# Altium project SingleChip-Rev2.PrjPcb (part 7 of 8)

## Sheet SFP_10GbE_Port0.SchDoc: =ProjectTitle
size A3; Author: Jaime I. Chait; Organization: NWES LLC; Address1: 111 SW 5th Ave, STE 3150; Address2: Portland, OR 97204; DocumentNumber: SCH-0001; Revision: 2; SheetNumber: 17; SheetTotal: 19
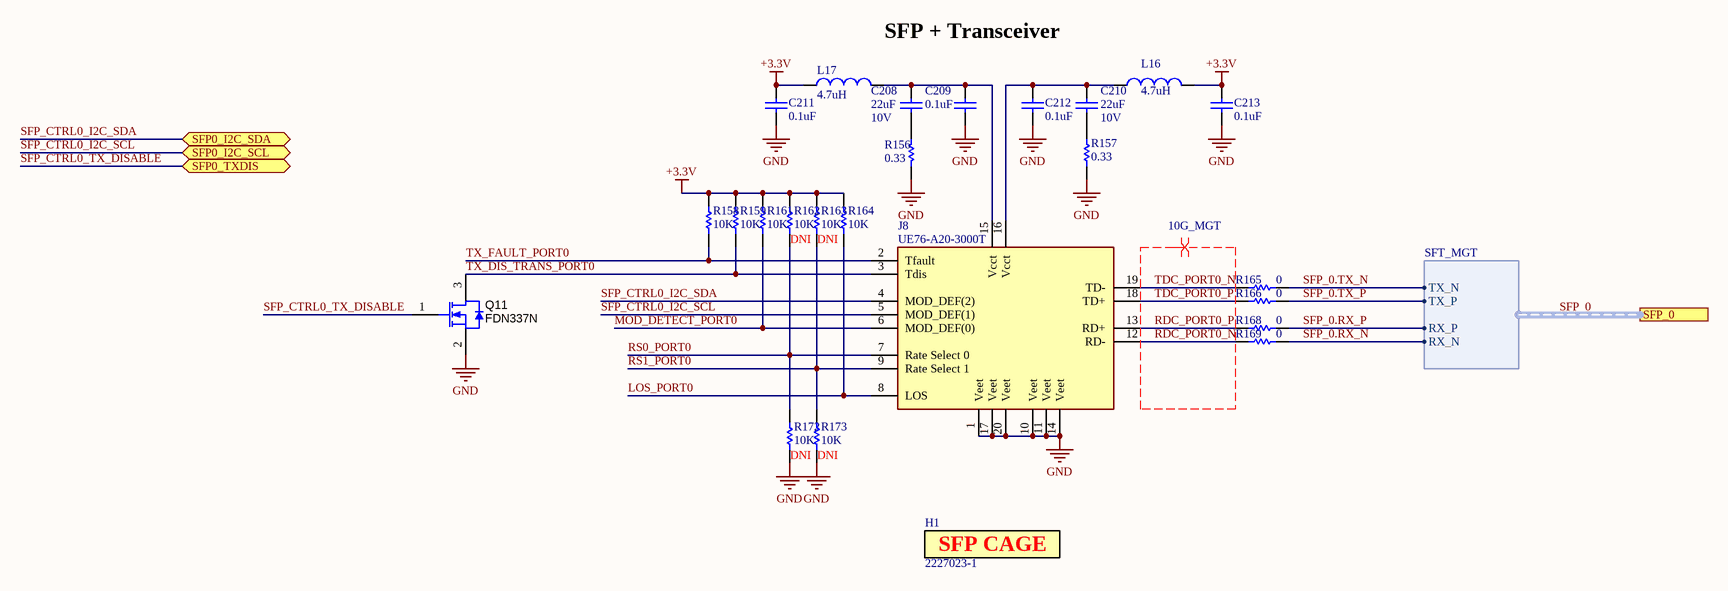
[diagram p13: SFP_10GbE_Port0.SchDoc]

### Parts
C208  22uF  Voltage Rating: 10V  [CAPC1608X100N]
C209  0.1uF  [CAPC1005X55USR]
C210  22uF  Voltage Rating: 10V  [CAPC1608X100N]
C211  0.1uF  [CAPC1005X55USR]
C212  0.1uF  [CAPC1005X55USR]
C213  0.1uF  [CAPC1005X55USR]
H1  2227023-1  [TE_2227023-1]
J8  UE76-A20-3000T  [AMPHENOL_UE76-A20-3000T]
L16  4.7uH  [DFE252012P]
L17  4.7uH  [DFE252012P]
Q11  FDN337N  [SOT-23]
R156  0.33  [RESC1608X55N]
R157  0.33  [RESC1608X55N]
R158  10K  [RESC1005X40USR]
R159  10K  [RESC1005X40USR]
R161  10K  [RESC1005X40USR]
R162  10K  [RESC1005X40USR]
R163  10K  [RESC1005X40USR]
R164  10K  [RESC1005X40USR]
R165  0  [RESC1005X40USR]
R166  0  [RESC1005X40USR]
R168  0  [RESC1005X40USR]
R169  0  [RESC1005X40USR]
R172  10K  [RESC1005X40USR]
R173  10K  [RESC1005X40USR]

### Ports
SFP0_I2C_SCL (bidir), SFP0_I2C_SDA (bidir), SFP0_TXDIS (bidir), SFP_0 (harness SFT_MGT)

### Harnesses
SFT_MGT: TX_N, TX_P, RX_P, RX_N

### Nets
+3.3V: C211.2 C213.2 L16.2 L17.2 R158.2 R159.2 R161.2 R162.2 R163.2 R164.2
GND: C209.1 C211.1 C212.1 C213.1 J8.1(Veet) J8.10(Veet) J8.11(Veet) J8.14(Veet) J8.17(Veet) J8.20(Veet) Q11.2(S) R156.1 R157.1 R172.1 R173.1
LOS_PORT0: J8.8(LOS) R164.1
MOD_DETECT_PORT0: J8.6(MOD_DEF(0)) R161.1
RDC_PORT0_N: J8.12(RD-) R169.1
RDC_PORT0_P: J8.13(RD+) R168.1
RS0_PORT0: J8.7(Rate_Select_0) R162.1 R172.2
RS1_PORT0: J8.9(Rate_Select_1) R163.1 R173.2
SFP_0.RX_N: R169.2 ; port SFP_0.RX_N
SFP_0.RX_P: R168.2 ; port SFP_0.RX_P
SFP_0.TX_N: R165.2 ; port SFP_0.TX_N
SFP_0.TX_P: R166.2 ; port SFP_0.TX_P
SFP_CTRL0_I2C_SCL: J8.5(MOD_DEF(1)) ; port SFP0_I2C_SCL
SFP_CTRL0_I2C_SDA: J8.4(MOD_DEF(2)) ; port SFP0_I2C_SDA
SFP_CTRL0_TX_DISABLE: Q11.1(G) ; port SFP0_TXDIS
TDC_PORT0_N: J8.19(TD-) R165.1
TDC_PORT0_P: J8.18(TD+) R166.1
TX_DIS_TRANS_PORT0: J8.3(Tdis) Q11.3(D) R159.1
TX_FAULT_PORT0: J8.2(Tfault) R158.1
NetC208_1: C208.1 C209.2 J8.15(Vcct) L17.1
NetC208_2: C208.2 R156.2
NetC210_1: C210.1 C212.2 J8.16(Vcct) L16.1
NetC210_2: C210.2 R157.2

### Buses and harness runs
harness SFP_0 = port SFP_0

### Layout directives
differential pair; differential pair class 10G_MGT: RDC_PORT0_N, RDC_PORT0_P, TDC_PORT0_N, TDC_PORT0_P

### Notes on the sheet
- SFP + Transceiver
- (near R162) DNI
- (near R163) DNI
- (near R172) DNI
- (near R173) DNI
- Title
- Size:
- Date:
- A4
- Number:
- Time:
- Revision:
- Sheet
- of
- File:
- (in symbol TE_2227023-1) SFP CAGE

### Library data of the parts
C208 C210 = CAP CER 22UF 10V X5R 0603: Multilayer Ceramic Capacitor, 22 uF, 10 V, ± 20%, X5R, 0603 [1608 Metric]; Manufacturer: TDK; Manufacturer Part Number: C1608X5R1A226M080AC; Supplier 1: Digi-Key; RoHS: Yes; Category: Ceramic Capacitors; Stock 1: 4100481; Pricing 1: 1=0.45000, 10=0.31300, 50=0.21920, 100=0.18790, 500=0.14090, 1000=0.11898 (USD); Mount: Surface Mount; Case/Package: 0603; Case Code (Metric): 1608; Case Code (Imperial): 0603; Dielectric Material: Ceramic; Weight: 7.1E-05oz; Min Operating Temperature: -55°C; Max Operating Temperature: 85°C; Tolerance: 20%; Capacitance: 22uF; Packaging: Tape and Reel; Voltage Rating (DC): 10V; Termination: SMD/SMT; Series: C; Package Quantity: 4000; Dielectric: X5R; Resistor Type: Ceramic; Length: 1.6mm; Width: 0.8mm; Height: 0.8mm; Thickness: 0.035inch; Depth: 0.8mm; Reach SVHC Compliant: Yes; Lead Free: Lead Free; RoHS Compliant: Yes; ComponentLink1URL: https://datasheet.ciiva.com/6274/tdkmlcccaprange-6274860.pdf?src-supplier=Digi-Key; ComponentLink1Description: https://datasheet.ciiva.com/6274/tdkmlcccaprange-6274860.pdf?src-supplier=Digi-Key; ComponentLink2URL: https://datasheet.ciiva.com/6274/tdkmlcccaprange-6274859.pdf?src-supplier=Digi-Key; ComponentLink2Description: https://datasheet.ciiva.com/6274/tdkmlcccaprange-6274859.pdf?src-supplier=Digi-Key; ComponentLink3URL: https://datasheet.ciiva.com/6274/tdkmlcccaprange-6274861.pdf?src-supplier=Digi-Key; ComponentLink3Description: https://datasheet.ciiva.com/6274/tdkmlcccaprange-6274861.pdf?src-supplier=Digi-Key; ComponentLink4URL: https://datasheet.ciiva.com/24216/mlcc-commercial-general-en-24216575.pdf?src-supplier=Mouser; ComponentLink4Description: https://datasheet.ciiva.com/24216/mlcc-commercial-general-en-24216575.pdf?src-supplier=Mouser; Supplier Part Number 1: 445-9077-1-ND
C209 C211-C213 = CAP CER 0.1UF 25V X5R 0402: Manufacturer Part Number: CL05A104KA5NNNC; Manufacturer: Samsung Electro-Mechanics; Supplier Part Number 1: 1276-1043-1-ND; Package: 0402; Height: 0.55mm; Supplier 1: Digi-Key; value: 0.1uF
H1 = TE_2227023-1: Connector Accessories 1 Port SFP Cage Press Fit Right Angle Through Hole Nickel Tray; Manufacturer: TE Connectivity AMP; Data Rate: 4Gbps; Number of Ports: 1; PCB Thickness: 0.059inch; Tail Length: 3mm; Supplier 1: Digi-Key; Supplier Part Number 1: A120615-ND; Manufacturer Part Number: 2227023-1; RoHS: Yes; Category: Connectors; Stock: 3865; Pricing: 1=2.23000, 24=1.98875, 48=1.97854, 96=1.95823, 240=1.79675, 456=1.78667, 960=1.62516, 2400=1.45356 (USD); Mounting Technology: Through Hole; Packaging: Tray; Termination: Press-Fit; Connector Type: SFP; Features: Shielded; Series: -; Number of Positions: 1; ELV: Compliant; RoHS Compliant: Yes; ComponentLink1URL: https://datasheet.ciiva.com/45236/eng-cd-2227023-1-45236427.pdf?src-supplier=Avnet; ComponentLink1Description: https://datasheet.ciiva.com/45236/eng-cd-2227023-1-45236427.pdf?src-supplier=Avnet
J8 = UE76-A20-3000T: Conn SFP+ RCP 20 POS 0.8mm Solder RA SMD 20 Terminal 1 Port T/R; Manufacturer: Amphenol Communications Solutions; Supplier 1: Future Electronics; Manufacturer Part Number: UE76-A20-3000T; RoHS: No; Stock 1: 500; Pricing 1: 500=0.81500, 1000=0.79500, 1500=0.78000, 2000=0.77500, 2500=0.75000 (USD); Supplier Part Number 1: 9135124
L16 L17 = FIXED IND 4.7UH 2A 200 MOHM SMD: Manufacturer: Murata; Manufacturer Part Number: DFE252012P-4R7M=P2; Core Material: Ferrite; Shielding: Shielded; DC Resistance (DCR): 200mR; Test Frequency: 1MHz; Max DC Current: 1.4A; Tolerance: 20%; Supplier 1: Digi-Key; RoHS: Yes; Category: Fixed Inductors; Stock 1: 151905; Pricing 1: 1=0.31000, 10=0.27500, 25=0.24040, 50=0.20600, 100=0.18890, 250=0.17168, 500=0.16140, 1000=0.12362 (USD); Mount: Surface Mount; Case/Package: 1008; Case Code (Metric): 2520; Case Code (Imperial): 1008; Min Operating Temperature: -40°C; Max Operating Temperature: 125°C; Inductance: 4.7uH; Packaging: Tape and Reel; Resistor Type: Wirewound,Metal Alloy; Current Rating: 2A; Length: 0.098inch; Width: 0.079inch; Height - Seated (Max): 0.047inch; Depth: 2mm; RoHS Compliant: Yes; ComponentLink1URL: http://www.farnell.com/datasheets/2550138.pdf?src-supplier=Farnell; ComponentLink1Description: http://www.farnell.com/datasheets/2550138.pdf?src-supplier=Farnell; ComponentLink2URL: http://www.toko.co.jp/products/pdf/inductors/dfe252012p.pdf?src-supplier=Avnet; ComponentLink2Description: http://www.toko.co.jp/products/pdf/inductors/dfe252012p.pdf?src-supplier=Avnet; ComponentLink3URL: http://www.farnell.com/datasheets/2550138.pdf?src-supplier=Newark; ComponentLink3Description: http://www.farnell.com/datasheets/2550138.pdf?src-supplier=Newark; ComponentLink4URL: http://www.murata.com/~/media/webrenewal/products/inductor/chip/tokoproducts/wirewoundmetalalloychiptype/m_dfe252012p.ashx?src-supplier=Digi-Key; ComponentLink4Description: http://www.murata.com/~/media/webrenewal/products/inductor/chip/tokoproducts/wirewoundmetalalloychiptype/m_dfe252012p.ashx?src-supplier=Digi-Key; ComponentLink5URL: https://www.murata.com/~/media/webrenewal/products/inductor/chip/tokoproducts/wirewoundmetalalloychiptype/m_dfe252012p.ashx?src-supplier=Digi-Key; ComponentLink5Description: https://www.murata.com/~/media/webrenewal/products/inductor/chip/tokoproducts/wirewoundmetalalloychiptype/m_dfe252012p.ashx?src-supplier=Digi-Key; Supplier Part Number 1: 490-10651-1-ND
Q11 = MOSFET N-CH 30V 2.2A SUPERSOT3: MOSFET N-CH 30V 2.2A SSOT3; Manufacturer: ON Semiconductor / Fairchild; Drain to Source Resistance: 65mR; Gate to Source Voltage (Vgs): 8V; Power Dissipation: 500mW; Turn-Off Delay Time: 17ns; Element Configuration: Single; Rise Time: 10ns; Turn-On Delay Time: 4ns; Input Capacitance: 300pF; Number of Elements: 1; Threshold Voltage: 700mV; Polarity: N-CHANNEL; Supplier 1: Digi-Key; Manufacturer Part Number: FDN337N; RoHS: Yes; Category: MOSFETs; Stock 1: 48367; Pricing 1: 1=0.49000, 10=0.42000, 100=0.31350, 500=0.24636, 1000=0.19037 (USD); Mount: Surface Mount; Case/Package: TO-236-3; Number of Pins: 3; Contact Plating: Tin,Matte; Weight: 0.03g; Min Operating Temperature: -55°C; Max Operating Temperature: 150°C; Continuous Drain Current (ID): 2.2A; Packaging: Tape and Reel; Drain to Source Breakdown Voltage: 30V; Max Power Dissipation: 500mW; Drain to Source Voltage (Vdss): 30V; Fall Time: 10ns; Package Quantity: 3000; Rds On Max: 65mR; Voltage Rating (DC): 30V; Current Rating: 2.2A; On-State Resistance: 65mR; Series: -; Drain-source On Resistance-Max: 65mR; Dual Supply Voltage: 30V; Termination: SMD/SMT; Nominal Vgs: 700mV; Length: 2.92mm; Width: 3.05mm; Height: 0.94mm; Lead Free: Lead Free; RoHS Compliant: Yes; Reach SVHC Compliant: Yes; ComponentLink1URL: https://datasheet.ciiva.com/14092/fdn337n-eng-datasheet-14092051.pdf?src-supplier=Distrelec; ComponentLink1Description: https://datasheet.ciiva.com/14092/fdn337n-eng-datasheet-14092051.pdf?src-supplier=Distrelec; ComponentLink2URL: https://datasheet.ciiva.com/4442/fdn337n-44286-4442315.pdf?src-supplier=Mouser; ComponentLink2Description: https://datasheet.ciiva.com/4442/fdn337n-44286-4442315.pdf?src-supplier=Mouser; ComponentLink3URL: https://datasheet.ciiva.com/19470/871017-19470804.pdf?src-supplier=Jameco; ComponentLink3Description: https://datasheet.ciiva.com/19470/871017-19470804.pdf?src-supplier=Jameco; ComponentLink4URL: https://datasheet.ciiva.com/6037/fdn337n-6037720.pdf?src-supplier=Farnell; ComponentLink4Description: https://datasheet.ciiva.com/6037/fdn337n-6037720.pdf?src-supplier=Farnell; ComponentLink5URL: https://datasheet.ciiva.com/22681/220571-22681884.pdf?src-supplier=Element14; ComponentLink5Description: https://datasheet.ciiva.com/22681/220571-22681884.pdf?src-supplier=Element14; ComponentLink6URL: https://datasheet.ciiva.com/22655/220571-22655333.pdf?src-supplier=Element14; ComponentLink6Description: https://datasheet.ciiva.com/22655/220571-22655333.pdf?src-supplier=Element14; ComponentLink7URL: https://datasheet.ciiva.com/7968/220571-7968126.pdf?src-supplier=Element14; ComponentLink7Description: https://datasheet.ciiva.com/7968/220571-7968126.pdf?src-supplier=Element14; ComponentLink8URL: https://datasheet.ciiva.com/8115/fdn337n-8115069.pdf?src-supplier=Avnet; ComponentLink8Description: https://datasheet.ciiva.com/8115/fdn337n-8115069.pdf?src-supplier=Avnet; ComponentLink9URL: https://datasheet.ciiva.com/16931/fdn337n-16931214.pdf?src-supplier=Future+Electronics; ComponentLink9Description: https://datasheet.ciiva.com/16931/fdn337n-16931214.pdf?src-supplier=Future+Electronics; ComponentLink10URL: https://datasheet.ciiva.com/8115/fdn337n-8115063.pdf?src-supplier=Avnet; ComponentLink10Description: https://datasheet.ciiva.com/8115/fdn337n-8115063.pdf?src-supplier=Avnet; ComponentLink11URL: https://datasheet.ciiva.com/931/fdn337n-931876.pdf?src-supplier=Digi-Key; ComponentLink11Description: https://datasheet.ciiva.com/931/fdn337n-931876.pdf?src-supplier=Digi-Key; ComponentLink12URL: https://datasheet.ciiva.com/931/fdn337n-931877.pdf?src-supplier=Digi-Key; ComponentLink12Description: https://datasheet.ciiva.com/931/fdn337n-931877.pdf?src-supplier=Digi-Key; ComponentLink13URL: https://datasheet.ciiva.com/931/fdn337n-931875.pdf?src-supplier=Digi-Key; ComponentLink13Description: https://datasheet.ciiva.com/931/fdn337n-931875.pdf?src-supplier=Digi-Key; Supplier Part Number 1: FDN337NCT-ND
R156 R157 = RES 0.33 OHM 1% 1/10W 0603: Manufacturer: Panasonic Electronic Components; Manufacturer Part Number: ERJ-3RQFR33V; Supplier Part Number 1: P.33AJCT-ND; Supplier 1: Digi-Key; Height: 0.4mm; Package: 0402; value: 0.33
R158 R159 R161-R164 R172 R173 = RES 10K OHM 1% 1/16W 0402: Manufacturer: YAGEO; Manufacturer Part Number: RC0402FR-0710KL; Supplier Part Number 1: 311-10.0KLRCT-ND; Package: 0402; Height: 0.4mm; Supplier 1: Digi-Key; value: 10K; Tolerance: ±1%
R165 R166 R168 R169 = RES 0 OHM JUMPER 1/16W 0402: Manufacturer: Yageo; Manufacturer Part Number: RC0402JR-070RL; Supplier Part Number 1: 311-0.0JRTR-ND; Package: 0402; Height: 0.4mm; Supplier 1: Digi-Key; value: 0

## Sheet Clock-Gen.SchDoc: =ProjectTitle
size A3; Author: Jaime I. Chait; Organization: NWES LLC; Address1: 111 SW 5th Ave, STE 3150; Address2: Portland, OR 97204; DocumentNumber: SCH-0001; Revision: 2; SheetNumber: 18; SheetTotal: 19
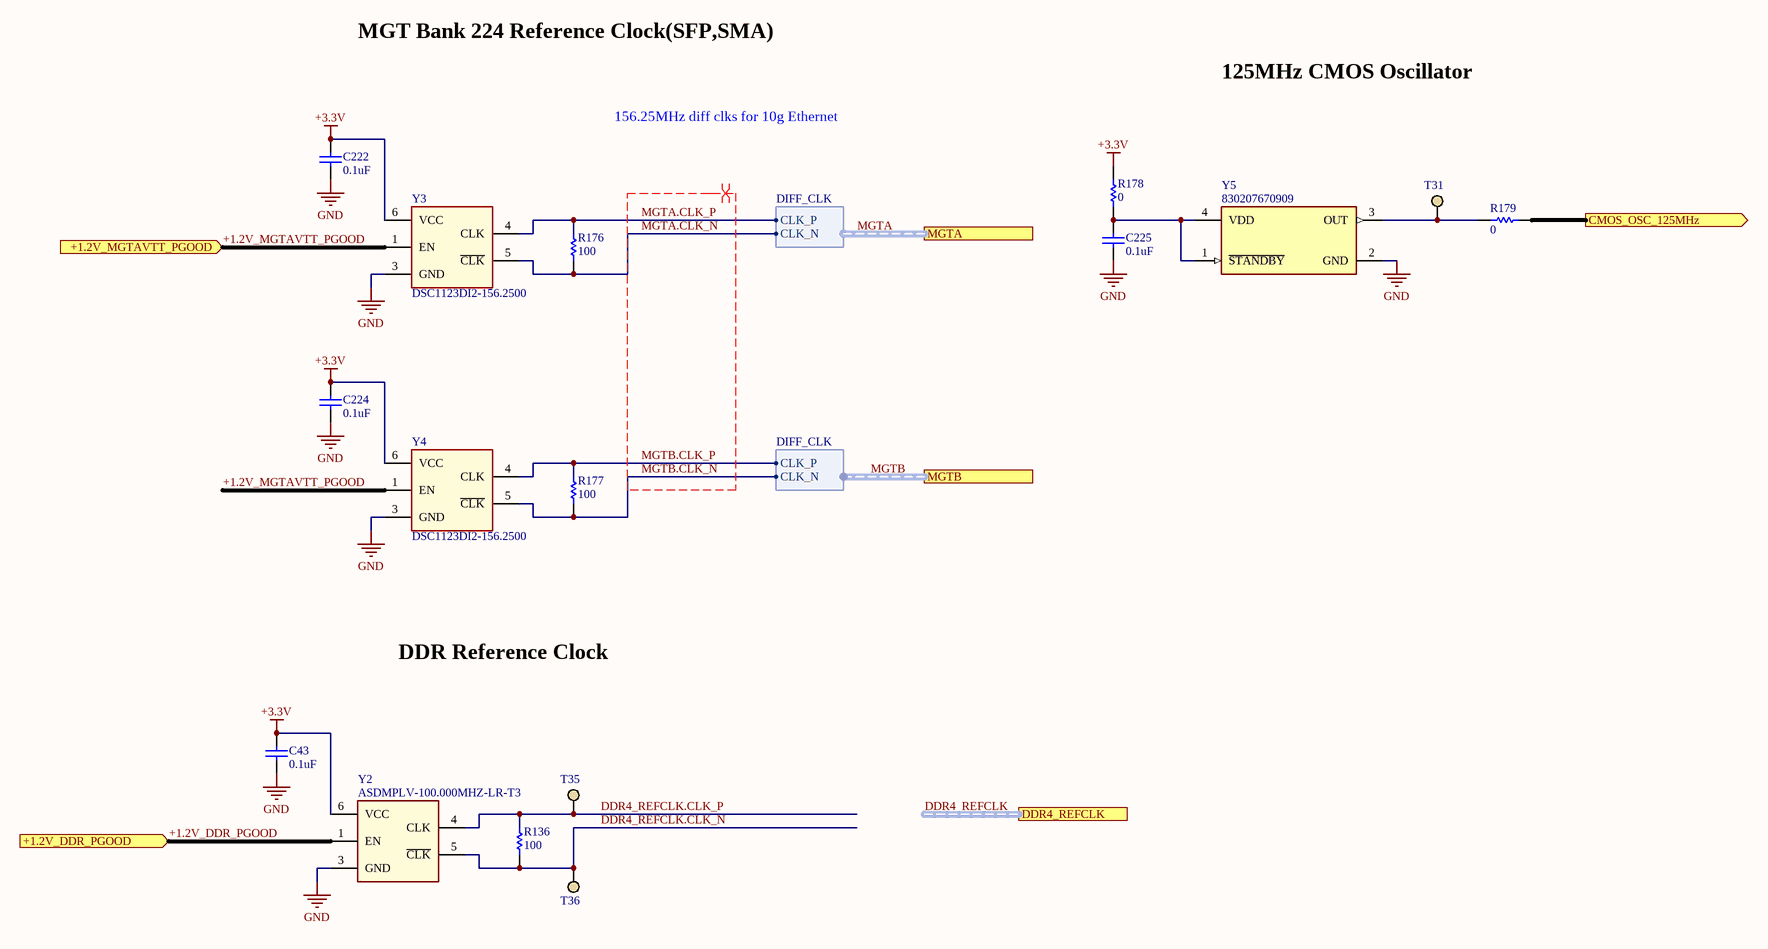
[diagram p14: Clock-Gen.SchDoc]

### Parts
C43  0.1uF  [CAPC1005X55USR]
C222  0.1uF  [CAPC1005X55USR]
C224  0.1uF  [CAPC1005X55USR]
C225  0.1uF  [CAPC1005X55USR]
R136  100  [RESC1005X40USR]
R176  100  [RESC1005X40USR]
R177  100  [RESC1005X40USR]
R178  0  [RESC1005X40USR]
R179  0  [RESC1005X40USR]
T31  TP_S  [TP_SM_1MM]  (value not drawn)  (no BOM)
T35  TP_S  [TP_SM_1MM]  (value not drawn)  (no BOM)
T36  TP_S  [TP_SM_1MM]  (value not drawn)  (no BOM)
Y2  ASDMPLV-100.000MHZ-LR-T3  [6-SMD (2.50mm x 2.00mm)]
Y3  DSC1123DI2-156.2500  [6-SMD (2.50mm x 2.00mm)]
Y4  DSC1123DI2-156.2500  [6-SMD (2.50mm x 2.00mm)]
Y5  830207670909  [XTAL_CX3225SA]

### Ports
+1.2V_DDR_PGOOD (in), +1.2V_MGTAVTT_PGOOD (in), CMOS_OSC_125MHz (out), DDR4_REFCLK (harness DIFF_CLK), MGTA (harness DIFF_CLK), MGTB (harness DIFF_CLK)

### Harnesses
DIFF_CLK: CLK_P, CLK_N

### Nets
+3.3V: C43.1 C222.1 C224.1 R178.1 Y2.6(VCC) Y3.6(VCC) Y4.6(VCC)
GND: C43.2 C222.2 C224.2 C225.2 Y2.3(GND) Y3.3(GND) Y4.3(GND) Y5.2(GND)
+1.2V_DDR_PGOOD: Y2.1(EN) ; port +1.2V_DDR_PGOOD
+1.2V_MGTAVTT_PGOOD: Y3.1(EN) Y4.1(EN) ; port +1.2V_MGTAVTT_PGOOD
CMOS_OSC_125MHz: R179.2 ; port CMOS_OSC_125MHz
DDR4_REFCLK.CLK_N: R136.1 T36.1 Y2.5(~{CLK})
DDR4_REFCLK.CLK_P: R136.2 T35.1 Y2.4(CLK)
MGTA.CLK_N: R176.1 Y3.5(~{CLK}) ; port MGTA.CLK_N
MGTA.CLK_P: R176.2 Y3.4(CLK) ; port MGTA.CLK_P
MGTB.CLK_N: R177.1 Y4.5(~{CLK}) ; port MGTB.CLK_N
MGTB.CLK_P: R177.2 Y4.4(CLK) ; port MGTB.CLK_P
NetC225_1: C225.1 R178.2 Y5.1(~{STANDBY}) Y5.4(VDD)
NetR179_1: R179.1 T31.1 Y5.3(OUT)

### Buses and harness runs
harness DDR4_REFCLK = port DDR4_REFCLK
harness MGTA = port MGTA
harness MGTB = port MGTB

### Layout directives
differential pair: MGTA.CLK_N, MGTA.CLK_P, MGTB.CLK_N, MGTB.CLK_P

### Notes on the sheet
- MGT Bank 224 Reference Clock(SFP,SMA)
- 125MHz CMOS Oscillator
- 156.25MHz diff clks for 10g Ethernet
- DDR Reference Clock
- Title
- Size:
- Date:
- A4
- Number:
- Time:
- Revision:
- Sheet
- of
- File:

### Library data of the parts
C43 C222 C224 C225 = CAP CER 0.1UF 25V X5R 0402: as C209 on sheet SFP_10GbE_Port0; Supplier Part Number 1: 1276-1043-1-ND; Package: 0402; Height: 0.55mm; Supplier 1: Digi-Key; value: 0.1uF
R136 R176 R177 = RES 100 OHM 1% 1/16W 0402: Manufacturer: YAGEO; Manufacturer Part Number: RC0402FR-07100RL; Supplier Part Number 1: 311-100LRCT-ND; Supplier 1: Digi-Key; Height: 0.4mm; Package: 0402; value: 100
R178 R179 = RES 0 OHM JUMPER 1/16W 0402: as R165 on sheet SFP_10GbE_Port0; Supplier Part Number 1: 311-0.0JRTR-ND; Package: 0402; Height: 0.4mm; Supplier 1: Digi-Key; value: 0
T31 T35 T36 = Test point PAD: test point
Y2 = ASDMPLV-100.000MHZ-LR-T3: Oscillator MEMS 100MHz ±25ppm (Stability) LVDS 52% 2.5V/3.3V 6-Pin QFN SMD T/R; Manufacturer: Abracon; Load Capacitance: 2pF; Max Supply Voltage: 3.6V; Min Supply Voltage: 2.25V; Max Supply Current: 32mA; Supplier 1: Newark; Manufacturer Part Number: ASDMPLV-100.000MHZ-LR-T3; RoHS: Yes; Category: Oscillators; Pricing 1: 1=5.72000, 25=5.68000, 50=5.45000, 100=4.95000, 250=4.83000, 500=4.71000, 1000=4.19000, 3000=4.19000 (USD); Mount: Surface Mount; Case/Package: SMD/SMT; Number of Pins: 6; Min Operating Temperature: -40°C; Max Operating Temperature: 85°C; Packaging: Tape and Reel; Frequency: 100MHz; Frequency Stability: 25ppm; Termination: Solder; Output Format: LVDS; Series: Pure Silicon™ ASDMP; Length: 0.098inch; Width: 0.079inch; Height: 0.033inch; ComponentLink1URL: https://datasheet.ciiva.com/6724/asdmp-6724229.pdf?src-supplier=Digi-Key; ComponentLink1Description: https://datasheet.ciiva.com/6724/asdmp-6724229.pdf?src-supplier=Digi-Key; ComponentLink2URL: https://datasheet.ciiva.com/6724/asdmp-6724565.pdf?src-supplier=Digi-Key; ComponentLink2Description: https://datasheet.ciiva.com/6724/asdmp-6724565.pdf?src-supplier=Digi-Key; Supplier Part Number 1: 56AC7564
Y3 Y4 = DSC1123DI2-156.2500: MEMS Oscillator High Perf Single LVDS Output -40C-85C 25ppm; Manufacturer: Microchip; Frequency: 156.25MHz; Max Supply Current: 32mA; Supplier 1: Digi-Key; Manufacturer Part Number: DSC1123DI2-156.2500; RoHS: Yes; Category: Timers and Oscillators; Stock 1: 484; Pricing 1: 1=3.06000, 25=2.55000, 100=2.50500 (USD); Mount: Surface Mount; Case/Package: SMD/SMT; Min Operating Temperature: -40°C; Max Operating Temperature: 85°C; Frequency Stability: 25ppm; Packaging: Rail/Tube; Length: 0.098inch; Width: 0.079inch; Height: 0.035inch; Ratings: AEC-Q100; ComponentLink1URL: http://www.mouser.com/ds/2/268/DSC1103-23-776891.pdf?src-supplier=Mouser; ComponentLink1Description: http://www.mouser.com/ds/2/268/DSC1103-23-776891.pdf?src-supplier=Mouser; ComponentLink2URL: http://components.arrow.com/part/dataview/66696476S862967N1374?src-supplier=Arrow+Electronics; ComponentLink2Description: http://components.arrow.com/part/dataview/66696476S862967N1374?src-supplier=Arrow+Electronics; ComponentLink3URL: http://www.microchip.com/mymicrochip/filehandler.aspx?ddocname=en576728&src-supplier=Digi-Key; ComponentLink3Description: http://www.microchip.com/mymicrochip/filehandler.aspx?ddocname=en576728&src-supplier=Digi-Key; Supplier Part Number 1: DSC1123DI2-156.2500-ND
Y5 = 830207670909: Xtal Osc Xo 125.0000MHZ Cmos; Manufacturer: Wurth Electronics; Supplier 1: Digi-Key; Manufacturer Part Number: 830207670909; RoHS: No; Category: Oscillators; Stock 1: 3000; Pricing 1: 1=3.06000, 10=2.87500, 50=2.75000, 100=2.62500, 500=2.43750, 1000=2.25000 (USD); Supplier Part Number 1: 1923-830207670909CT-ND

## Sheet OX05B1S_CAM0.SchDoc: =ProjectTitle
size A3; DocumentNumber: SCH-0001; SheetNumber: 15; SheetTotal: 19
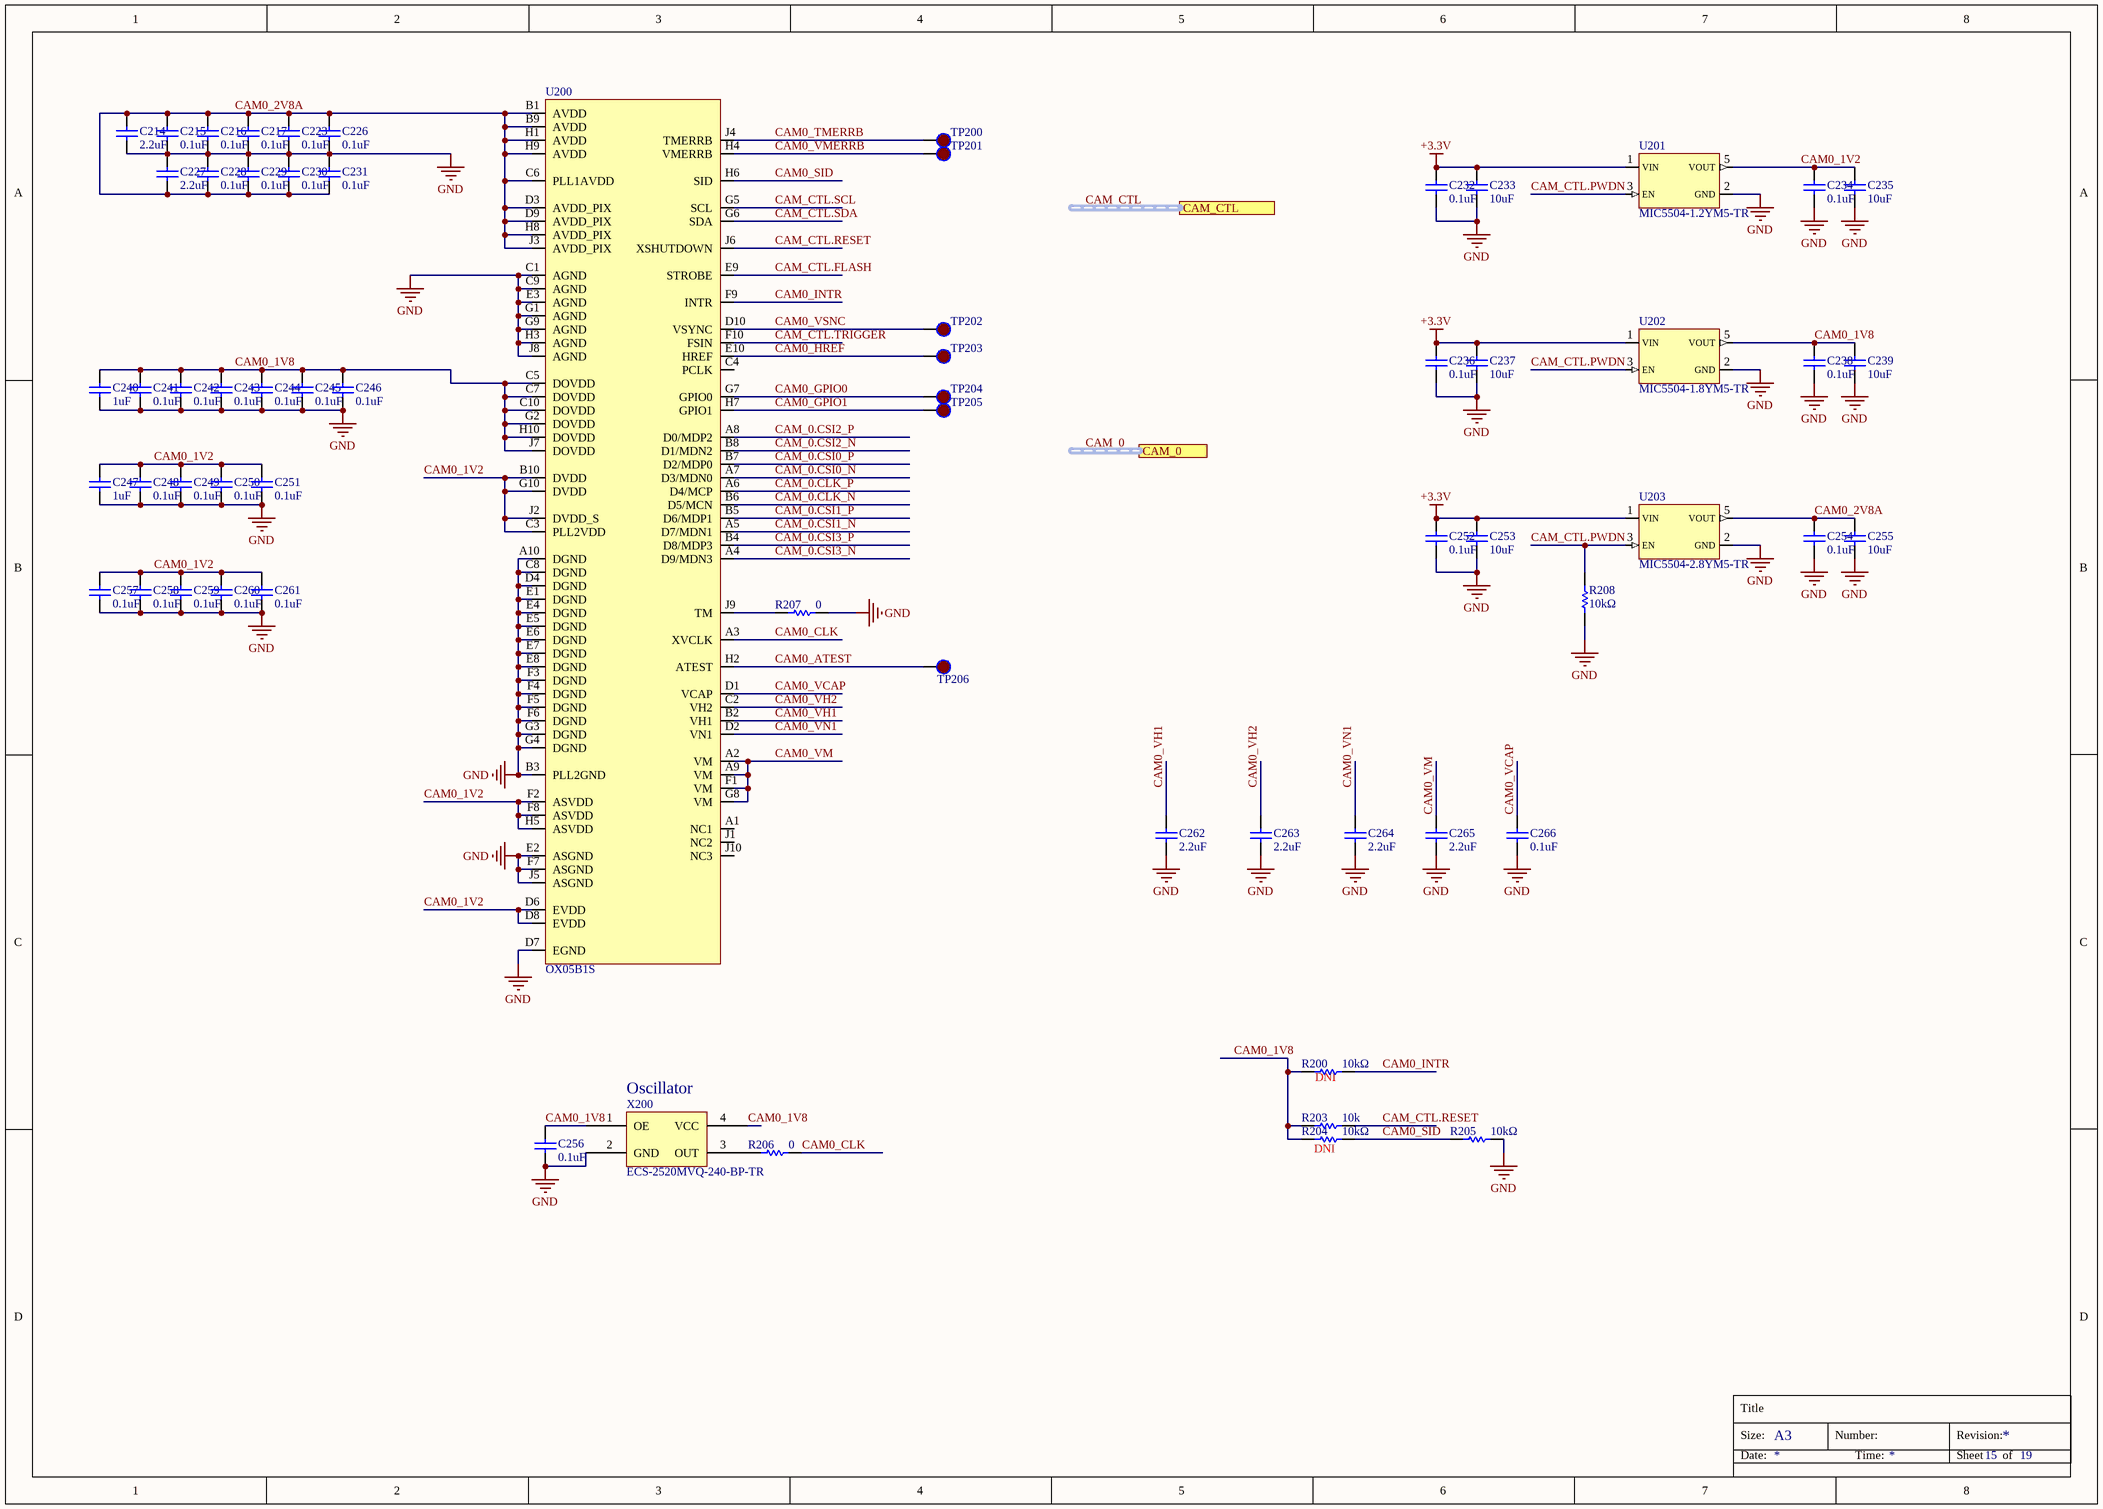
[diagram p15: OX05B1S_CAM0.SchDoc]

### Parts
C214  2.2uF  [0402_CAP_NP]
C215  0.1uF  [0402_CAP_NP]
C216  0.1uF  [0402_CAP_NP]
C217  0.1uF  [0402_CAP_NP]
C223  0.1uF  [0402_CAP_NP]
C226  0.1uF  [0402_CAP_NP]
C227  2.2uF  [0402_CAP_NP]
C228  0.1uF  [0402_CAP_NP]
C229  0.1uF  [0402_CAP_NP]
C230  0.1uF  [0402_CAP_NP]
C231  0.1uF  [0402_CAP_NP]
C232  0.1uF  [0402_CAP_NP]
C233  10uF  [0603_CAP_NP]
C234  0.1uF  [0402_CAP_NP]
C235  10uF  [0603_CAP_NP]
C236  0.1uF  [0402_CAP_NP]
C237  10uF  [0603_CAP_NP]
C238  0.1uF  [0402_CAP_NP]
C239  10uF  [0603_CAP_NP]
C240  1uF  [0402_CAP_NP]
C241  0.1uF  [0402_CAP_NP]
C242  0.1uF  [0402_CAP_NP]
C243  0.1uF  [0402_CAP_NP]
C244  0.1uF  [0402_CAP_NP]
C245  0.1uF  [0402_CAP_NP]
C246  0.1uF  [0402_CAP_NP]
C247  1uF  [0402_CAP_NP]
C248  0.1uF  [0402_CAP_NP]
C249  0.1uF  [0402_CAP_NP]
C250  0.1uF  [0402_CAP_NP]
C251  0.1uF  [0402_CAP_NP]
C252  0.1uF  [0402_CAP_NP]
C253  10uF  [0603_CAP_NP]
C254  0.1uF  [0402_CAP_NP]
C255  10uF  [0603_CAP_NP]
C256  0.1uF  [0402_CAP_NP]
C257  0.1uF  [0402_CAP_NP]
C258  0.1uF  [0402_CAP_NP]
C259  0.1uF  [0402_CAP_NP]
C260  0.1uF  [0402_CAP_NP]
C261  0.1uF  [0402_CAP_NP]
C262  2.2uF  [0402_CAP_NP]
C263  2.2uF  [0402_CAP_NP]
C264  2.2uF  [0402_CAP_NP]
C265  2.2uF  [0402_CAP_NP]
C266  0.1uF  [0402_CAP_NP]
R200  value 10kΩ  Populate: DNI  [0603_RES]  (hidden comment: 10k)
R203  10k  [0402_RES]
R204  value 10kΩ  Populate: DNI  [0603_RES]  (hidden comment: 10k)
R205  value 10kΩ  [0603_RES]  (hidden comment: 10k)
R206  0  [0603_RES]
R207  0  [0603_RES]
R208  value 10kΩ  [0603_RES]  (hidden comment: 10k)
TP200  TestPoint_1mm_SM  [TESTPAD_1mm]  (value not drawn)  (no BOM)
TP201  TestPoint_1mm_SM  [TESTPAD_1mm]  (value not drawn)  (no BOM)
TP202  TestPoint_1mm_SM  [TESTPAD_1mm]  (value not drawn)  (no BOM)
TP203  TestPoint_1mm_SM  [TESTPAD_1mm]  (value not drawn)  (no BOM)
TP204  TestPoint_1mm_SM  [TESTPAD_1mm]  (value not drawn)  (no BOM)
TP205  TestPoint_1mm_SM  [TESTPAD_1mm]  (value not drawn)  (no BOM)
TP206  TestPoint_1mm_SM  [TESTPIN_1mm]  (value not drawn)  (no BOM)
U200  OX05B1S  [BGA_OX05B1S]
U201  MIC5504-1.2YM5-TR  [SOT23-5]
U202  MIC5504-1.8YM5-TR  [SOT23-5]
U203  MIC5504-2.8YM5-TR  [SOT23-5]
X200  ECS-2520MVQ-240-BP-TR  [Active Oscillator 2520]

### Ports
CAM_0 (harness MIPI), CAM_CTL (harness CAM_CTL)

### Nets
+3.3V: C232.2 C233.2 C236.2 C237.2 C252.2 C253.2 U201.1(VIN) U202.1(VIN) U203.1(VIN)
GND: C214.1 C215.1 C216.1 C217.1 C223.1 C226.1 C227.2 C228.2 C229.2 C230.2 C231.2 C232.1 C233.1 C234.1 C235.1 C236.1 C237.1 C238.1 C239.1 C240.1 C241.1 C242.1 C243.1 C244.1 C245.1 C246.1 C247.1 C248.1 C249.1 C250.1 C251.1 C252.1 C253.1 C254.1 C255.1 C256.1 C257.1 C258.1 C259.1 C260.1 C261.1 C262.1 C263.1 C264.1 C265.1 C266.1 R205.1 R207.2 R208.2 U200.A10(DGND) U200.B3(PLL2GND) U200.C1(AGND) U200.C8(DGND) U200.C9(AGND) U200.D4(DGND) U200.D7(EGND) U200.E1(DGND) U200.E2(ASGND) U200.E3(AGND) U200.E4(DGND) U200.E5(DGND) U200.E6(DGND) U200.E7(DGND) U200.E8(DGND) U200.F3(DGND) U200.F4(DGND) U200.F5(DGND) U200.F6(DGND) U200.F7(ASGND) U200.G1(AGND) U200.G3(DGND) U200.G4(DGND) U200.G9(AGND) U200.H3(AGND) U200.J5(ASGND) U200.J8(AGND) U201.2(GND) U202.2(GND) U203.2(GND) X200.2(GND)
CAM0_1V2: C234.2 C235.2 C247.2 C248.2 C249.2 C250.2 C251.2 C257.2 C258.2 C259.2 C260.2 C261.2 U200.B10(DVDD) U200.C3(PLL2VDD) U200.D6(EVDD) U200.D8(EVDD) U200.F2(ASVDD) U200.F8(ASVDD) U200.G10(DVDD) U200.H5(ASVDD) U200.J2(DVDD_S) U201.5(VOUT)
CAM0_1V8: C238.2 C239.2 C240.2 C241.2 C242.2 C243.2 C244.2 C245.2 C246.2 C256.2 R200.2 R203.2 R204.2 U200.C5(DOVDD) U200.C7(DOVDD) U200.C10(DOVDD) U200.G2(DOVDD) U200.H10(DOVDD) U200.J7(DOVDD) U202.5(VOUT) X200.1(OE) X200.4(VCC)
CAM0_2V8A: C214.2 C215.2 C216.2 C217.2 C223.2 C226.2 C227.1 C228.1 C229.1 C230.1 C231.1 C254.2 C255.2 U200.B1(AVDD) U200.B9(AVDD) U200.C6(PLL1AVDD) U200.D3(AVDD_PIX) U200.D9(AVDD_PIX) U200.H1(AVDD) U200.H8(AVDD_PIX) U200.H9(AVDD) U200.J3(AVDD_PIX) U203.5(VOUT)
CAM0_ATEST: TP206.1 U200.H2(ATEST)
CAM0_CLK: R206.2 U200.A3(XVCLK)
CAM0_GPIO0: TP204.1 U200.G7(GPIO0)
CAM0_GPIO1: TP205.1 U200.H7(GPIO1)
CAM0_HREF: TP203.1 U200.E10(HREF)
CAM0_INTR: R200.1 U200.F9(INTR)
CAM0_SID: R204.1 R205.2 U200.H6(SID)
CAM0_TMERRB: TP200.1 U200.J4(TMERRB)
CAM0_VCAP: C266.2 U200.D1(VCAP)
CAM0_VH1: C262.2 U200.B2(VH1)
CAM0_VH2: C263.2 U200.C2(VH2)
CAM0_VM: C265.2 U200.A2(VM) U200.A9(VM) U200.F1(VM) U200.G8(VM)
CAM0_VMERRB: TP201.1 U200.H4(VMERRB)
CAM0_VN1: C264.2 U200.D2(VN1)
CAM0_VSNC: TP202.1 U200.D10(VSYNC)
CAM_0.CLK_N: U200.B6(D5/MCN)
CAM_0.CLK_P: U200.A6(D4/MCP)
CAM_0.CSI0_N: U200.A7(D3/MDN0)
CAM_0.CSI0_P: U200.B7(D2/MDP0)
CAM_0.CSI1_N: U200.A5(D7/MDN1)
CAM_0.CSI1_P: U200.B5(D6/MDP1)
CAM_0.CSI2_N: U200.B8(D1/MDN2)
CAM_0.CSI2_P: U200.A8(D0/MDP2)
CAM_0.CSI3_N: U200.A4(D9/MDN3)
CAM_0.CSI3_P: U200.B4(D8/MDP3)
CAM_CTL.FLASH: U200.E9(STROBE)
CAM_CTL.PWDN: R208.1 U201.3(EN) U202.3(EN) U203.3(EN)
CAM_CTL.RESET: R203.1 U200.J6(XSHUTDOWN)
CAM_CTL.SCL: U200.G5(SCL)
CAM_CTL.SDA: U200.G6(SDA)
CAM_CTL.TRIGGER: U200.F10(FSIN)
NetR206_1: R206.1 X200.3(OUT)
NetR207_1: R207.1 U200.J9(TM)

Not connected (* = marked no-connect by the designer): U200 A1(NC1) C4(PCLK) J1(NC2) J10(NC3)

### Buses and harness runs
harness CAM_0 = port CAM_0
harness CAM_CTL = port CAM_CTL

### Notes on the sheet
- (near X200) Oscillator
- Title
- Size:
- Date:
- A3
- Number:
- Time:
- Revision:
- Sheet
- of

### Library data of the parts
C214 C227 C262-C265 = 0402C_2.2UF_6.3V_10%_X5R: CAP CER 2.2UF 6.3V X5R ±10% 0402; Manufacturer: Murata; Manufacturer Part Number: GRM155R60J225KE95D; Unit Cost, Qty 1: $0.13; Unit Cost, Qty 500: $0.03126; Value: 2.2uF
C215-C217 C223 C226 C228-C232 C234 C236 C238 C241-C246 C248-C252 C254 C256-C261 C266 = 0402C_0.1UF_25V_10%_X7R: CAP CER 0.1UF 25V X7R 0402; Manufacturer: AVX; Manufacturer Part Number: 04023C104KAT2A; Unit Cost, Qty 1: $0.12; Unit Cost, Qty 500: $0.02758; Value: 0.1uF
C233 C235 C237 C239 C253 C255 = 0603C_10UF_10V_20%_X5R: CAP CER 10UF 10V X5R 0603; Manufacturer: Taiyo Yuden; Manufacturer Part Number: LMK107BBJ106MALT; Component Description: 10 µF ±20% 10V Ceramic Capacitor X5R 0603; Unit Cost, Qty 1: $0.18; Unit Cost, Qty 500: 0.04188; Value: 10uF
C240 C247 = 0402C_1UF_16V_10%_X5R: CAP CER 1UF 16V X5R 0402 ±10%; Manufacturer: Taiyo Yuden; Manufacturer Part Number: EMK105BJ105KV-F; Unit Cost, Qty 1: $0.14; Unit Cost, Qty 500: $0.034; Value: 1uF
R200 R204 R205 R208 = 0603R_10k_1%_0.1W: RES SMD 10K OHM 1% 1/10W 0603; Manufacturer: Yageo; Manufacturer Part Number: RC0603FR-0710KL; Component Description: Resistor 10k Ohm ±1% 0.1W 0603; Unit Cost, Qty 1: $0.10; Unit Cost, Qty 500: $0.00316
R203 = 0402R_10k_1%_0.063W: RES SMD 10K OHM 1% 1/16W 0402; Manufacturer: Yageo; Manufacturer Part Number: RC0402FR-0710KL
R206 = 0603R_0_0.1W: Resistor 0 ohm 0.1W 0603; MPN: RC0603JR-070RL; Mfg: Yageo; Unit Cost, Qty 1: $0.10; Unit Cost, Qty 500: $0.002252; Value: 0
R207 = 0603R_0_0.1W: Resistor 0 ohm 0.1W 0603; Manufacturer: Yageo; Manufacturer Part Number: RC0603JR-070RL; Unit Cost, Qty 1: $0.10; Unit Cost, Qty 500: $0.002252; Value: 0
TP200-TP206 = TestPoint_1mm_SM: Populate: DNP
U200 = OX05B1S: 1/2.53" CMOS 5MP image sensor; Manufacturer: OMNIVISION; Manufacturer Part Number: OX05B1S
U201 = MIC550x: IC REG LINEAR 1.2V 300MA SOT23-5; Manufacturer: Microchip; Dropout Voltage: 160mV; Number of Regulators: 1; Min Current Limit: 400mA; Supplier 1: Digikey; Supplier Part Number 1: 576-4878-1-ND; Manufacturer Part Number: MIC5504-1.2YM5-TR; RoHS: Yes; Category: Voltage Regulators - Linear; Stock 1: 9823; Pricing 1: 1=0.16000, 25=0.12000, 100=0.11000 (USD); Mount: Surface Mount; Case/Package: SOT-23-5; Min Operating Temperature: -40°C; Max Operating Temperature: 125°C; Packaging: Cut Tape; Output Voltage: 1.2V; Output Current: 300mA; Series: -; RoHS Compliant: Yes; ComponentLink1URL: http://www.microchip.com/mymicrochip/filehandler.aspx?ddocname=en580292&src-supplier=Digikey; ComponentLink1Description: http://www.microchip.com/mymicrochip/filehandler.aspx?ddocname=en580292&src-supplier=Digikey; ComponentLink2URL: https://datasheet.octopart.com/MIC5504-1.2YM5-TR-Microchip-datasheet-137404938.pdf?src-supplier=Future+Electronics; ComponentLink2Description: https://datasheet.octopart.com/MIC5504-1.2YM5-TR-Microchip-datasheet-137404938.pdf?src-supplier=Future+Electronics; ComponentLink3URL: https://datasheet.octopart.com/MIC5504-1.2YM5-TR-Microchip-datasheet-137453438.pdf?src-supplier=Master+Electronics; ComponentLink3Description: https://datasheet.octopart.com/MIC5504-1.2YM5-TR-Microchip-datasheet-137453438.pdf?src-supplier=Master+Electronics
U202 = MIC550x: Linear Voltage Regulator IC Positive Fixed 1 Output 1.8V 300mA SOT-23-5; Manufacturer: Microchip; Dropout Voltage: 160mV; Number of Regulators: 1; Min Current Limit: 400mA; Supplier 1: Digikey; Supplier Part Number 1: 576-4879-1-ND; Manufacturer Part Number: MIC5504-1.8YM5-TR; RoHS: Yes; Category: Voltage Regulators - Linear; Stock 1: 307926; Pricing 1: 1=0.16000, 25=0.12000, 100=0.11000 (USD); Mount: Surface Mount; Case/Package: SOT-23-5; Min Operating Temperature: -40°C; Max Operating Temperature: 125°C; Packaging: Cut Tape; Series: -; Output Voltage: 1.8V; Output Current: 300mA; RoHS Compliant: Yes
U203 = MIC550x: LDO Fixed Output Voltage Regulator MIC5504-2.8YM5-TR, 2.8V, 300mA, SOT23-5 /tape-3k/; Manufacturer: Microchip; Dropout Voltage: 160mV; Number of Regulators: 1; Min Current Limit: 400mA; Min Input Voltage: 2.5V; Max Input Voltage: 5.5V; Operating Supply Current: 42uA; Power Supply Rejection Ratio (PSRR): 60dB; Quiescent Current: 35uA; Accuracy: 3%; Supplier 1: Digikey; Supplier Part Number 1: 576-4763-1-ND; Manufacturer Part Number: MIC5504-2.8YM5-TR; RoHS: Yes; Category: Voltage Regulators - Linear; Stock 1: 39893; Pricing 1: 1=0.16000, 25=0.12000, 100=0.11000 (USD); Mount: Surface Mount; Case/Package: SOT-23-5; Number of Pins: 5; Min Operating Temperature: -40°C; Max Operating Temperature: 125°C; Packaging: Tape and Reel; Output Voltage: 2.8V; Output Current: 300mA; Nominal Output Voltage: 2.8V; Output Type: Fixed; Series: -; Number of Outputs: 1; Max Output Current: 300mA; Length: 2.9mm; Width: 1.6mm; Height: 1.1mm; Reach SVHC Compliant: No; ComponentLink1URL: https://datasheet.ciiva.com/46425/1856860-46425638.pdf?src-supplier=Element14; ComponentLink1Description: https://datasheet.ciiva.com/46425/1856860-46425638.pdf?src-supplier=Element14
X200 = Oscillator_2520: Oscillator XO 24MHz ±50ppm 15pF HCMOS 55% 1.8V/2.5V/3.3V Automotive 4-Pin Mini-CSMD T/R; Manufacturer: ECS International; Max Supply Current: 10mA; Supplier 1: Digikey; Supplier Part Number 1: 50-ECS-2520MVQ-240-BP-CT-ND; Manufacturer Part Number: ECS-2520MVQ-240-BP-TR; RoHS: Yes; Category: Oscillators; Stock 1: 12794; Pricing 1: 1=1.15000, 10=1.09900, 50=1.07380, 100=0.92040, 500=0.89484 (USD); Mount: Surface Mount; Case/Package: SMD/SMT; Min Operating Temperature: -40°C; Max Operating Temperature: 105°C; Series: MultiVolt™ ECS-2520MVQ; Frequency Stability: 50ppm; Frequency: 24MHz; Ratings: AEC-Q200; RoHS Compliant: Yes

## Sheet Serializer.SchDoc: =ProjectTitle
size A3; DocumentNumber: SCH-0001; SheetNumber: 15; SheetTotal: 19
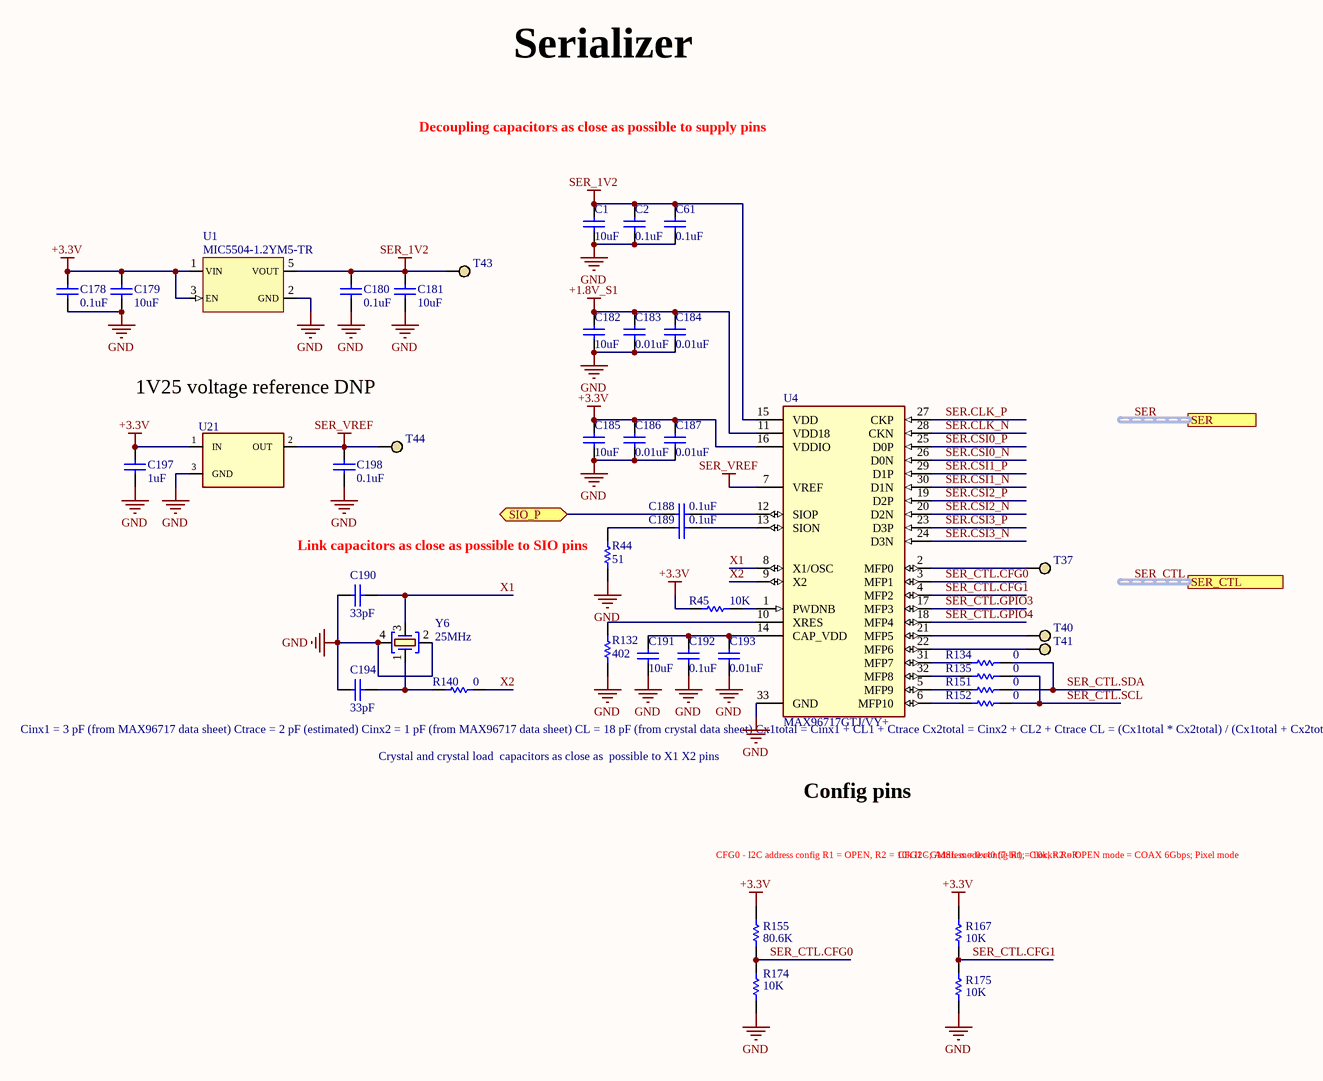
[diagram p16: Serializer.SchDoc]

### Parts
C1  10uF  [CAPC1005X55USR]
C2  0.1uF  [CAPC1005X55USR]
C61  0.1uF  [CAPC1005X55USR]
C178  0.1uF  [CAPC1005X55USR]
C179  10uF  [CAPC1608X90N]
C180  0.1uF  [CAPC1005X55USR]
C181  10uF  [CAPC1608X90N]
C182  10uF  [CAPC1005X55USR]
C183  0.01uF  [CAPC1005X55USR]
C184  0.01uF  [CAPC1005X55USR]
C185  10uF  [CAPC1005X55USR]
C186  0.01uF  [CAPC1005X55USR]
C187  0.01uF  [CAPC1005X55USR]
C188  0.1uF  [CAPC1005X55USR]
C189  0.1uF  [CAPC1005X55USR]
C190  33pF  [CAPC1005X55USR]
C191  10uF  [CAPC1005X55USR]
C192  0.1uF  [CAPC1005X55USR]
C193  0.01uF  [CAPC1005X55USR]
C194  33pF  [CAPC1005X55USR]
C197  1uF  [CAPC1005X55USR]
C198  0.1uF  [CAPC1005X55USR]
R44  51  [RESC1005X40USR]
R45  10K  [RESC1005X40USR]
R132  402  [RESC1005X40USR]
R134  0  [RESC1005X40USR]
R135  0  [RESC1005X40USR]
R140  0  [RESC1005X40USR]
R151  0  [RESC1005X40USR]
R152  0  [RESC1005X40USR]
R155  80.6K  [RESC1005X40USR]
R167  10K  [RESC1005X40USR]
R174  10K  [RESC1005X40USR]
R175  10K  [RESC1005X40USR]
T37  TP_S  [TP 1mm]  (value not drawn)  (no BOM)
T40  TP_S  [TP 1mm]  (value not drawn)  (no BOM)
T41  TP_S  [TP 1mm]  (value not drawn)  (no BOM)
T43  TP_S  [TP 1mm]  (value not drawn)  (no BOM)
T44  TP_S  [TP 1mm]  (value not drawn)  (no BOM)
U1  MIC5504-1.2YM5-TR  [SOT23-5]
U4  MAX96717GTJ/VY+  [QFN50P500X500X80-33N]
U21  REF3012AIDBZT  [SOT-23]  (value not drawn)
Y6  25MHz  [XTAL_ABM8G_3225]

### Ports
SER (harness MIPI), SER_CTL (harness SER_CTRL), SIO_P (bidir)

### Nets
+1.8V_S1: C182.2 C183.2 C184.2 U4.11(VDD18)
+3.3V: C178.2 C179.2 C185.2 C186.2 C187.2 C197.2 R45.2 R155.2 R167.2 U1.1(VIN) U1.3(EN) U4.16(VDDIO) U21.1(IN)
GND: C1.1 C2.2 C61.2 C178.1 C179.1 C180.1 C181.1 C182.1 C183.1 C184.1 C185.1 C186.1 C187.1 C190.1 C191.1 C192.2 C193.1 C194.1 C197.1 C198.1 R44.1 R132.1 R174.1 R175.1 U1.2(GND) U4.33(GND) U21.3(GND) Y6.2(SH) Y6.4(SH)
SER_1V2: C1.2 C2.1 C61.1 C180.2 C181.2 T43.1 U1.5(VOUT) U4.15(VDD)
SER_VREF: C198.2 T44.1 U4.7(VREF) U21.2(OUT)
SER.CLK_N: U4.28(CKN)
SER.CLK_P: U4.27(CKP)
SER.CSI0_N: U4.26(D0N)
SER.CSI0_P: U4.25(D0P)
SER.CSI1_N: U4.30(D1N)
SER.CSI1_P: U4.29(D1P)
SER.CSI2_N: U4.20(D2N)
SER.CSI2_P: U4.19(D2P)
SER.CSI3_N: U4.24(D3N)
SER.CSI3_P: U4.23(D3P)
SER_CTL.CFG0: R155.1 R174.2 U4.3(MFP1)
SER_CTL.CFG1: R167.1 R175.2 U4.4(MFP2)
SER_CTL.GPIO3: U4.17(MFP3)
SER_CTL.GPIO4: U4.18(MFP4)
SER_CTL.SCL: R135.2 R152.2
SER_CTL.SDA: R134.2 R151.2
X1: C190.2 U4.8(X1/OSC) Y6.3
X2: R140.2 U4.9(X2)
NetC188_1: C188.1 ; port SIO_P
NetC188_2: C188.2 U4.12(SIOP)
NetC189_1: C189.1 R44.2
NetC189_2: C189.2 U4.13(SION)
NetC191_2: C191.2 C192.1 C193.2 U4.14(CAP_VDD)
NetC194_2: C194.2 R140.1 Y6.1
NetR45_1: R45.1 U4.1(PWDNB)
NetR132_2: R132.2 U4.10(XRES)
NetR134_1: R134.1 U4.31(MFP7)
NetR135_1: R135.1 U4.32(MFP8)
NetR151_1: R151.1 U4.5(MFP9)
NetR152_1: R152.1 U4.6(MFP10)
NetT37_1: T37.1 U4.2(MFP0)
NetT40_1: T40.1 U4.21(MFP5)
NetT41_1: T41.1 U4.22(MFP6)

### Buses and harness runs
harness SER = port SER
harness SER_CTL = port SER_CTL

### Notes on the sheet
- Serializer
- Decoupling capacitors as close as possible to supply pins
- 1V25 voltage reference DNP
- (near R44) Link capacitors as close as possible to SIO pins
- Cinx1 = 3 pF (from MAX96717 data sheet)
  Ctrace = 2 pF (estimated)
  Cinx2 = 1 pF (from MAX96717 data sheet)
  CL = 18 pF (from crystal data sheet)
  Cx1total = Cinx1 + CL1 + Ctrace
  Cx2total = Cinx2 + CL2 + Ctrace
  CL = (Cx1total * Cx2total) / (Cx1total + Cx2total)
  CL1 = 33 pF
  Cl2 = 33 pF
  CX1total = 38 pF
  Cx2total = 36 pF
  CL = 18.5 pF (meets the requirements)
- Crystal and crystal load
  capacitors as close as
  possible to X1 X2 pins
- Config pins
- CFG0 - I2C address config
  R1 = OPEN, R2 = 10k
  I2C; Address = 0x40 (7-bit);
  Clock= RoR
- CFG1 - GMSL mode config
  R1 = 10k, R2 = OPEN
  mode = COAX 6Gbps; Pixel mode
- Title
- Size:
- Date:
- A3
- Number:
- Time:
- Revision:
- Sheet
- of

### Library data of the parts
C1 C182 C185 C191 = CAP CER 10UF 10V X5R 0402: Manufacturer Part Number: CL05A106MP8NUB8; Manufacturer: Samsung Electro-Mechanics; Part #: E-CAP-042; Supplier Part Number 1: 1276-6830-2-ND; Package: 0402; value: 10uF; Supplier 1: Digi-Key; Height: 0.9mm; ComponentLink1Description: New link; ComponentLink1URL: *
C2 C61 C188 C189 C192 = CAP CER 0.1UF 25V X5R 0402: as C209 on sheet SFP_10GbE_Port0; Supplier Part Number 1: 1276-1043-1-ND; Package: 0402; Height: 0.55mm; Supplier 1: Digi-Key; value: 0.1uF
C178 C180 C198 = 0402C_0.1UF_25V_10%_X7R: as C215 on sheet OX05B1S_CAM0; Value: 0.1uF
C179 C181 = 0603C_10UF_10V_20%_X5R: as C233 on sheet OX05B1S_CAM0; Value: 10uF
C183 C184 C186 C187 C193 = CAP CER 0.01uF 50V X7R 0402: CAP CER 10000PF 50V X7R 0402; Manufacturer Part Number: GCM155R71H103KA55D; Manufacturer: Murata Electronics; Supplier Part Number 1: 490-4762-1-ND; Package: 0402; Height: 0.55mm; Supplier 1: Digi-Key; value: 0.01uF
C190 C194 = CAP CER 33PF 50V C0G/NP0 0402: Manufacturer Part Number: GRM1555C1H330JA01D; Manufacturer: Murata Electronics; Part #: E-CAP-042; Supplier Part Number 1: 490-5936-1-ND; Package: 0402; Height: 0.55mm; Supplier 1: Digi-Key; value: 33pF
C197 = CAP CER 1UF 10V X5R 0402: Manufacturer Part Number: CL05A105MP5NNNC; Manufacturer: Samsung Electro-Mechanics; Part #: E-CAP-042; Supplier Part Number 1: 1276-1448-1-ND; Package: 0402; value: 1uF; Supplier 1: Digi-Key; Height: 0.55mm; ComponentLink1Description: New link; ComponentLink1URL: *
R44 = RES 51 OHM 1% 1/16W 0402: Manufacturer Part Number: RC0402FR-0751RL; Manufacturer: YAGEO; Supplier Part Number 1: 311-51.0LRCT-ND; Supplier 1: Digi-Key; Height: 0.4mm; Package: 0402; value: 51
R45 R167 R174 R175 = RES 10K OHM 1% 1/16W 0402: as R158 on sheet SFP_10GbE_Port0; Supplier Part Number 1: 311-10.0KLRCT-ND; Package: 0402; Height: 0.4mm; Supplier 1: Digi-Key; value: 10K
  R45: Tolerance: ±1%
R132 = RES 402 OHM 1% 1/16W 0402: Manufacturer Part Number: RC0402FR-07402RL; Manufacturer: YAGEO; Supplier Part Number 1: YAG3152CT-ND; Supplier 1: Digi-Key; Height: 0.4mm; Package: 0402; value: 402
R134 R135 R140 R151 R152 = RES 0 OHM JUMPER 1/16W 0402: as R165 on sheet SFP_10GbE_Port0; Supplier Part Number 1: 311-0.0JRTR-ND; Package: 0402; Height: 0.4mm; Supplier 1: Digi-Key; value: 0
R155 = RES 80.6K OHM 1% 1/16W 0402: Manufacturer: YAGEO; Manufacturer Part Number: RC0402FR-0780K6L; value: 80.6K; Supplier Part Number 1: 311-80.6KLRCT-ND; Supplier 1: Digi-Key; Height: 0.4mm; Package: 0402
T37 T40 T41 T43 T44 = Test point PAD: test point
U1 = MIC550x: as U201 on sheet OX05B1S_CAM0; Supplier 1: Digikey; Supplier Part Number 1: 576-4878-1-ND; Manufacturer Part Number: MIC5504-1.2YM5-TR; RoHS: Yes; Category: Voltage Regulators - Linear; Stock 1: 9823; Pricing 1: 1=0.16000, 25=0.12000, 100=0.11000 (USD); Mount: Surface Mount; Case/Package: SOT-23-5; Min Operating Temperature: -40°C; Max Operating Temperature: 125°C; Packaging: Cut Tape; Output Voltage: 1.2V; Output Current: 300mA; Series: -; RoHS Compliant: Yes; ComponentLink1URL: http://www.microchip.com/mymicrochip/filehandler.aspx?ddocname=en580292&src-supplier=Digikey; ComponentLink1Description: http://www.microchip.com/mymicrochip/filehandler.aspx?ddocname=en580292&src-supplier=Digikey; ComponentLink2URL: https://datasheet.octopart.com/MIC5504-1.2YM5-TR-Microchip-datasheet-137404938.pdf?src-supplier=Future+Electronics; ComponentLink2Description: https://datasheet.octopart.com/MIC5504-1.2YM5-TR-Microchip-datasheet-137404938.pdf?src-supplier=Future+Electronics; ComponentLink3URL: https://datasheet.octopart.com/MIC5504-1.2YM5-TR-Microchip-datasheet-137453438.pdf?src-supplier=Master+Electronics; ComponentLink3Description: https://datasheet.octopart.com/MIC5504-1.2YM5-TR-Microchip-datasheet-137453438.pdf?src-supplier=Master+Electronics
U4 = MAX96717GTJ/VY+: GMSL2 Compact Serializer; Manufacturer: Maxim; Supplier 1: Digikey; Supplier Part Number 1: 505-MAX96717GTJ/VY+-ND; Manufacturer Part Number: MAX96717GTJ/VY+; RoHS: No; Stock: 259; Pricing: 1=15.02, 10=10.718, 25=9.6132, 80=8.54788, 230=7.82974, 490=7.42722, 980=7.3625 (USD)
U21 = REF3012AIDBZT: 1.25V 50ppm/Degrees C, 50uA in SOT23-3 Series (Bandgap) Voltage Reference 3-SOT-23 -40 to 125; Manufacturer: Texas Instruments; Max Supply Voltage: 5.5V; Max Output current: 25mA; Min Input Voltage: 1.8V; Tolerance: 0.2%; Temperature Coefficient: 50ppm/°C; Min Output Voltage: 1.248V; Reference Type: Series,Fixed; Supply Current: 42uA; Number of Channels: 1; Supplier 1: Digikey; Supplier Part Number 1: REF3012AIDBZTCT-ND; Manufacturer Part Number: REF3012AIDBZT; RoHS: Yes; Category: Voltage References; Stock: 4243; Pricing: 1=1.29, 10=0.94, 25=0.8516, 100=0.754, 250=0.70748, 500=0.67942, 750=0.66537, 1250=0.64981, 1750=0.6407, 2500=0.63196, 6250=0.61311, 12500=0.60176 (USD); Case/Package: SOT-23; Pins: 3; Min Operating Temperature: -40°C; Max Operating Temperature: 125°C; Packaging: Tape and Reel; Output Voltage: 1.25V; Package Quantity: 1; Quiescent Current: 50uA; Output Current: 25mA; Max Supply Current: 50uA; Reference Voltage: 1.25V; Termination: SMD/SMT; Series: -; Max Output Voltage: 1.25V; Length: 2.92mm; Width: 1.3mm; Height: 1mm; Radiation Hardening: No; Reach SVHC Compliant: No; Lead Free: Lead Free; RoHS Compliant: Yes; ComponentLink1URL: https://datasheet.ciiva.com/2007/ref3012-2007153.pdf?src-supplier=Digikey; ComponentLink1Description: https://datasheet.ciiva.com/2007/ref3012-2007153.pdf?src-supplier=Digikey; ComponentLink2URL: https://datasheet.ciiva.com/2007/ref3012-2007154.pdf?src-supplier=Digikey; ComponentLink2Description: https://datasheet.ciiva.com/2007/ref3012-2007154.pdf?src-supplier=Digikey; ComponentLink3URL: https://datasheet.ciiva.com/2007/ref3012-2007155.pdf?src-supplier=Digikey; ComponentLink3Description: https://datasheet.ciiva.com/2007/ref3012-2007155.pdf?src-supplier=Digikey; ComponentLink4URL: https://datasheet.ciiva.com/3235/ref3033-3235533.pdf?src-supplier=Avnet; ComponentLink4Description: https://datasheet.ciiva.com/3235/ref3033-3235533.pdf?src-supplier=Avnet; ComponentLink5URL: https://datasheet.ciiva.com/3235/ref3033-3235534.pdf?src-supplier=Avnet; ComponentLink5Description: https://datasheet.ciiva.com/3235/ref3033-3235534.pdf?src-supplier=Avnet
Y6 = XTAL_ABM8G-25.000MHZ-18-D2Y-T3: Crystal 25MHz ±20ppm (Tol) ±30ppm (Stability) 18pF FUND 60Ohm 4-Pin Ultra Mini-CSMD T/R; Manufacturer: Abracon; ESR (Equivalent Series Resistance): 60R; Supplier 1: Mouser; Supplier Part Number 1: 815-ABM8G2518D2YT3; Manufacturer Part Number: ABM8G-25.000MHZ-18-D2Y-T3; RoHS: Yes; Category: Crystals; Stock: 10548; Pricing: 1=0.46, 10=0.365, 50=0.365, 100=0.348, 1000=0.284, 10000=0.257 (USD); Mounting Technology: Surface Mount; Case/Package: SMD/SMT; Pins: 4; Min Operating Temperature: -40°C; Max Operating Temperature: 85°C; Package Quantity: 3000; Frequency: 25MHz; Frequency Tolerance: 20ppm; Load Capacitance: 18pF; Packaging: Tape and Reel; Tolerance: 20ppm; Frequency Stability: 30ppm; Termination: SMD/SMT; ESR: 60R; Series: ABM8G; Length: 3.2mm; Width: 2.5mm; Height: 0.039inch; Depth: 2.5mm; Radiation Hardening: No; ComponentLink1URL: https://datasheet.ciiva.com/862/abm8g-862352.pdf?src-supplier=Digikey; ComponentLink1Description: https://datasheet.ciiva.com/862/abm8g-862352.pdf?src-supplier=Digikey; ComponentLink2URL: https://datasheet.ciiva.com/3176/abm8g-3176078.pdf?src-supplier=Avnet; ComponentLink2Description: https://datasheet.ciiva.com/3176/abm8g-3176078.pdf?src-supplier=Avnet

## Sheet FPGA_MGT.SchDoc: =ProjectTitle
size A3; Author: Jaime I. Chait; Organization: NWES LLC; Address1: 111 SW 5th Ave, STE 3150; Address2: Portland, OR 97204; DocumentNumber: SCH-0001; Revision: 2; SheetNumber: 16; SheetTotal: 19
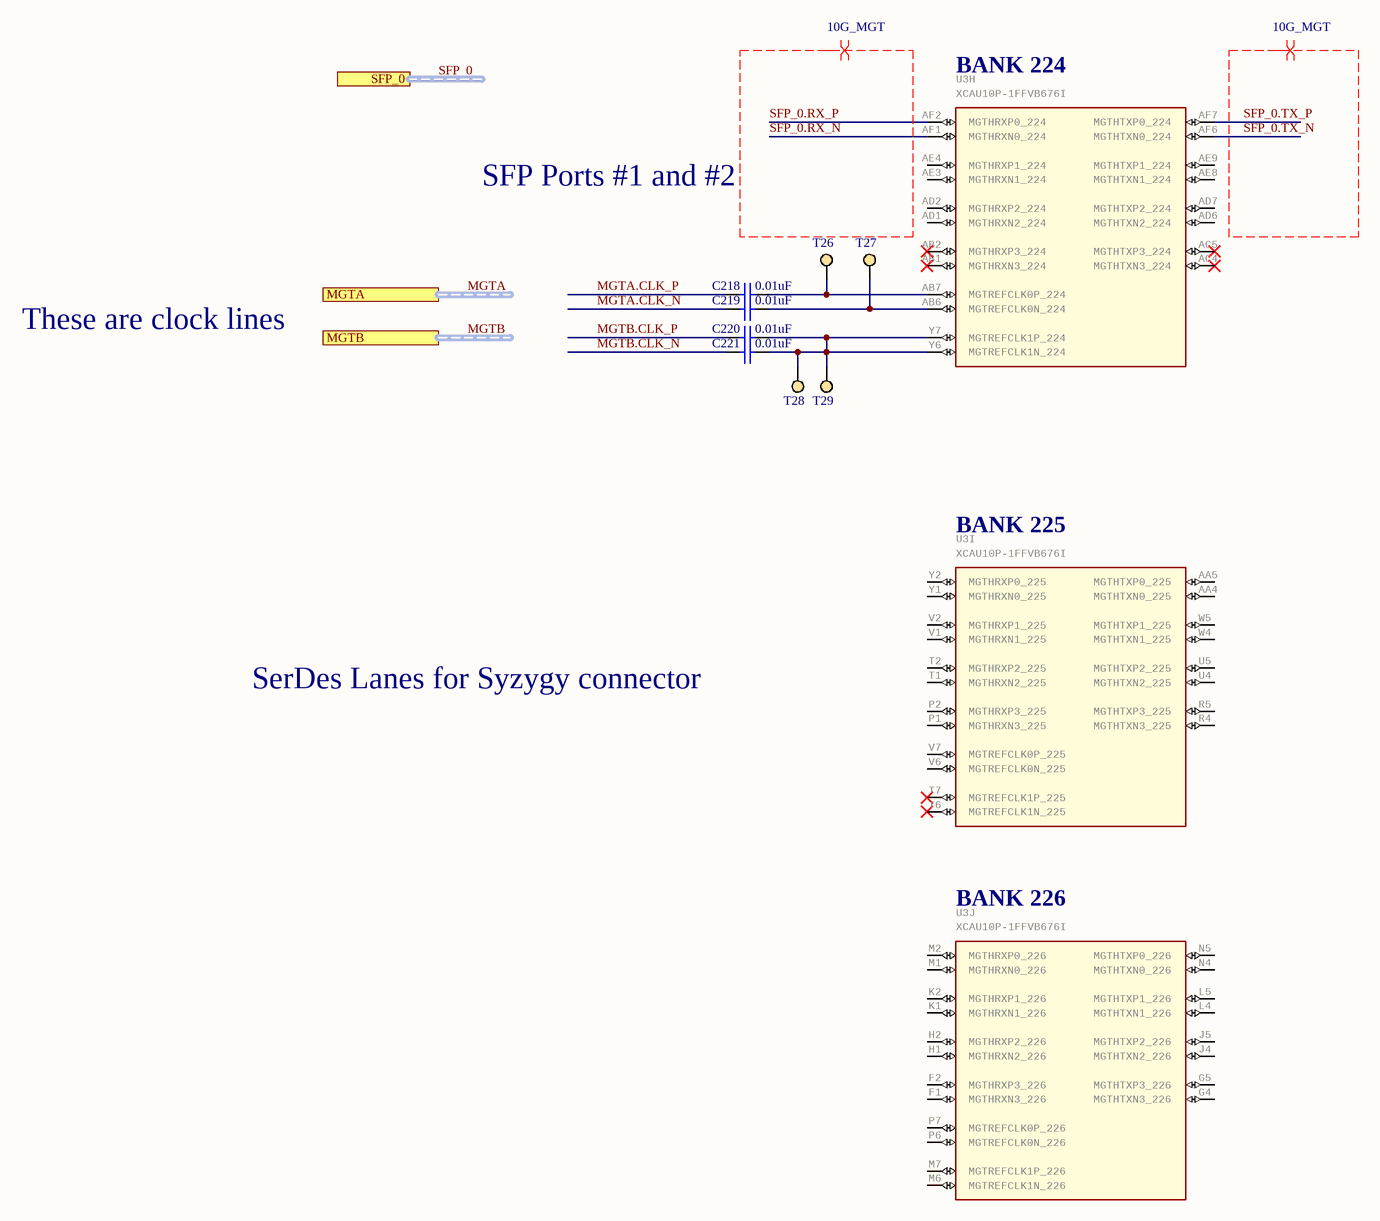
[diagram p17: FPGA_MGT.SchDoc]

### Parts
C218  0.01uF  [CAPC1005X55USR]
C219  0.01uF  [CAPC1005X55USR]
C220  0.01uF  [CAPC1005X55USR]
C221  0.01uF  [CAPC1005X55USR]
T26  TP_S  [TP_SM_1MM]  (value not drawn)  (no BOM)
T27  TP_S  [TP_SM_1MM]  (value not drawn)  (no BOM)
T28  TP_S  [TP_SM_1MM]  (value not drawn)  (no BOM)
T29  TP_S  [TP_SM_1MM]  (value not drawn)  (no BOM)
U3  XCAU10P-1FFVB676I  [676-FCBGA (27x27)]  (parts H,I,J of 16)

### Ports
MGTA (harness DIFF_CLK), MGTB (harness DIFF_CLK), SFP_0 (harness SFT_MGT)

### Nets
MGTA.CLK_N: C219.1
MGTA.CLK_P: C218.1
MGTB.CLK_N: C221.1
MGTB.CLK_P: C220.1
SFP_0.RX_N: U3.AF1(MGTHRXN0_224)
SFP_0.RX_P: U3.AF2(MGTHRXP0_224)
SFP_0.TX_N: U3.AF6(MGTHTXN0_224)
SFP_0.TX_P: U3.AF7(MGTHTXP0_224)
NetC218_2: C218.2 T26.1 U3.AB7(MGTREFCLK0P_224)
NetC219_2: C219.2 T27.1 U3.AB6(MGTREFCLK0N_224)
NetC220_2: C220.2 C221.2 T28.1 T29.1 U3.Y6(MGTREFCLK1N_224) U3.Y7(MGTREFCLK1P_224)

Not connected (* = marked no-connect by the designer): U3 AA4(MGTHTXN0_225) AA5(MGTHTXP0_225) AB1(MGTHRXN3_224)* AB2(MGTHRXP3_224)* AC4(MGTHTXN3_224)* AC5(MGTHTXP3_224)* AD1(MGTHRXN2_224) AD2(MGTHRXP2_224) AD6(MGTHTXN2_224) AD7(MGTHTXP2_224) AE3(MGTHRXN1_224) AE4(MGTHRXP1_224) AE8(MGTHTXN1_224) AE9(MGTHTXP1_224) F1(MGTHRXN3_226) F2(MGTHRXP3_226) G4(MGTHTXN3_226) G5(MGTHTXP3_226) H1(MGTHRXN2_226) H2(MGTHRXP2_226) J4(MGTHTXN2_226) J5(MGTHTXP2_226) K1(MGTHRXN1_226) K2(MGTHRXP1_226) L4(MGTHTXN1_226) L5(MGTHTXP1_226) M1(MGTHRXN0_226) M2(MGTHRXP0_226) M6(MGTREFCLK1N_226) M7(MGTREFCLK1P_226) N4(MGTHTXN0_226) N5(MGTHTXP0_226) P1(MGTHRXN3_225) P2(MGTHRXP3_225) P6(MGTREFCLK0N_226) P7(MGTREFCLK0P_226) R4(MGTHTXN3_225) R5(MGTHTXP3_225) T1(MGTHRXN2_225) T2(MGTHRXP2_225) T6(MGTREFCLK1N_225)* T7(MGTREFCLK1P_225)* U4(MGTHTXN2_225) U5(MGTHTXP2_225) V1(MGTHRXN1_225) V2(MGTHRXP1_225) V6(MGTREFCLK0N_225) V7(MGTREFCLK0P_225) W4(MGTHTXN1_225) W5(MGTHTXP1_225) Y1(MGTHRXN0_225) Y2(MGTHRXP0_225)

### Buses and harness runs
harness MGTA = port MGTA
harness MGTB = port MGTB
harness SFP_0 = port SFP_0

### Layout directives
differential pair; differential pair class 10G_MGT: SFP_0.RX_N, SFP_0.RX_P, SFP_0.TX_N, SFP_0.TX_P

### Notes on the sheet
- SFP Ports #1 and #2
- These are clock lines
- SerDes Lanes for Syzygy connector
- Title
- Size:
- Date:
- A4
- Number:
- Time:
- Revision:
- Sheet
- of
- File:
- (in symbol XCAU10P-1FFVB676I, part H) BANK 224
- (in symbol XCAU10P-1FFVB676I, part I) BANK 225
- (in symbol XCAU10P-1FFVB676I, part J) BANK 226

### Library data of the parts
C218-C221 = CAP CER 0.01uF 50V X7R 0402: as C183 on sheet Serializer; Supplier Part Number 1: 490-4762-1-ND; Package: 0402; Height: 0.55mm; Supplier 1: Digi-Key; value: 0.01uF
T26-T29 = Test point PAD: test point
U3 = XCAU10P-1FFVB676I: IC FPGA ARTIXUP 676BGA; Manufacturer: AMD Xilinx; Manufacturer Part Number: XCAU10P-1FFVB676I; Supplier Part Number 1: 122-XCAU10P-1FFVB676I-ND; Supplier 1: Supplier

## Sheet EVK External Connector.SchDoc: =ProjectTitle
size A3; PageSetup: Record=PageOptions|CenterHorizontal=True|CenterVertical=True|PrintScale=1.00|XCorrection=1.00|YCorrection=1.00|PrintKind=0|BorderSize=5000000|LeftOffset=0|BottomOffset=0|Orientation=2|PaperLength=1000|PaperWidth=1000|Scale=100|PaperSource=15|PrintQuality=600|MediaType=1|DitherType=10|PaperKind=Letter|PrintScaleMode=1; Author: Jaime I. Chait; Organization: NWES LLC; Address1: 111 SW 5th Ave, STE 3150; Address2: Portland, OR 97204; DocumentNumber: SCH-0001; Revision: 2; SheetNumber: 19; SheetTotal: 19
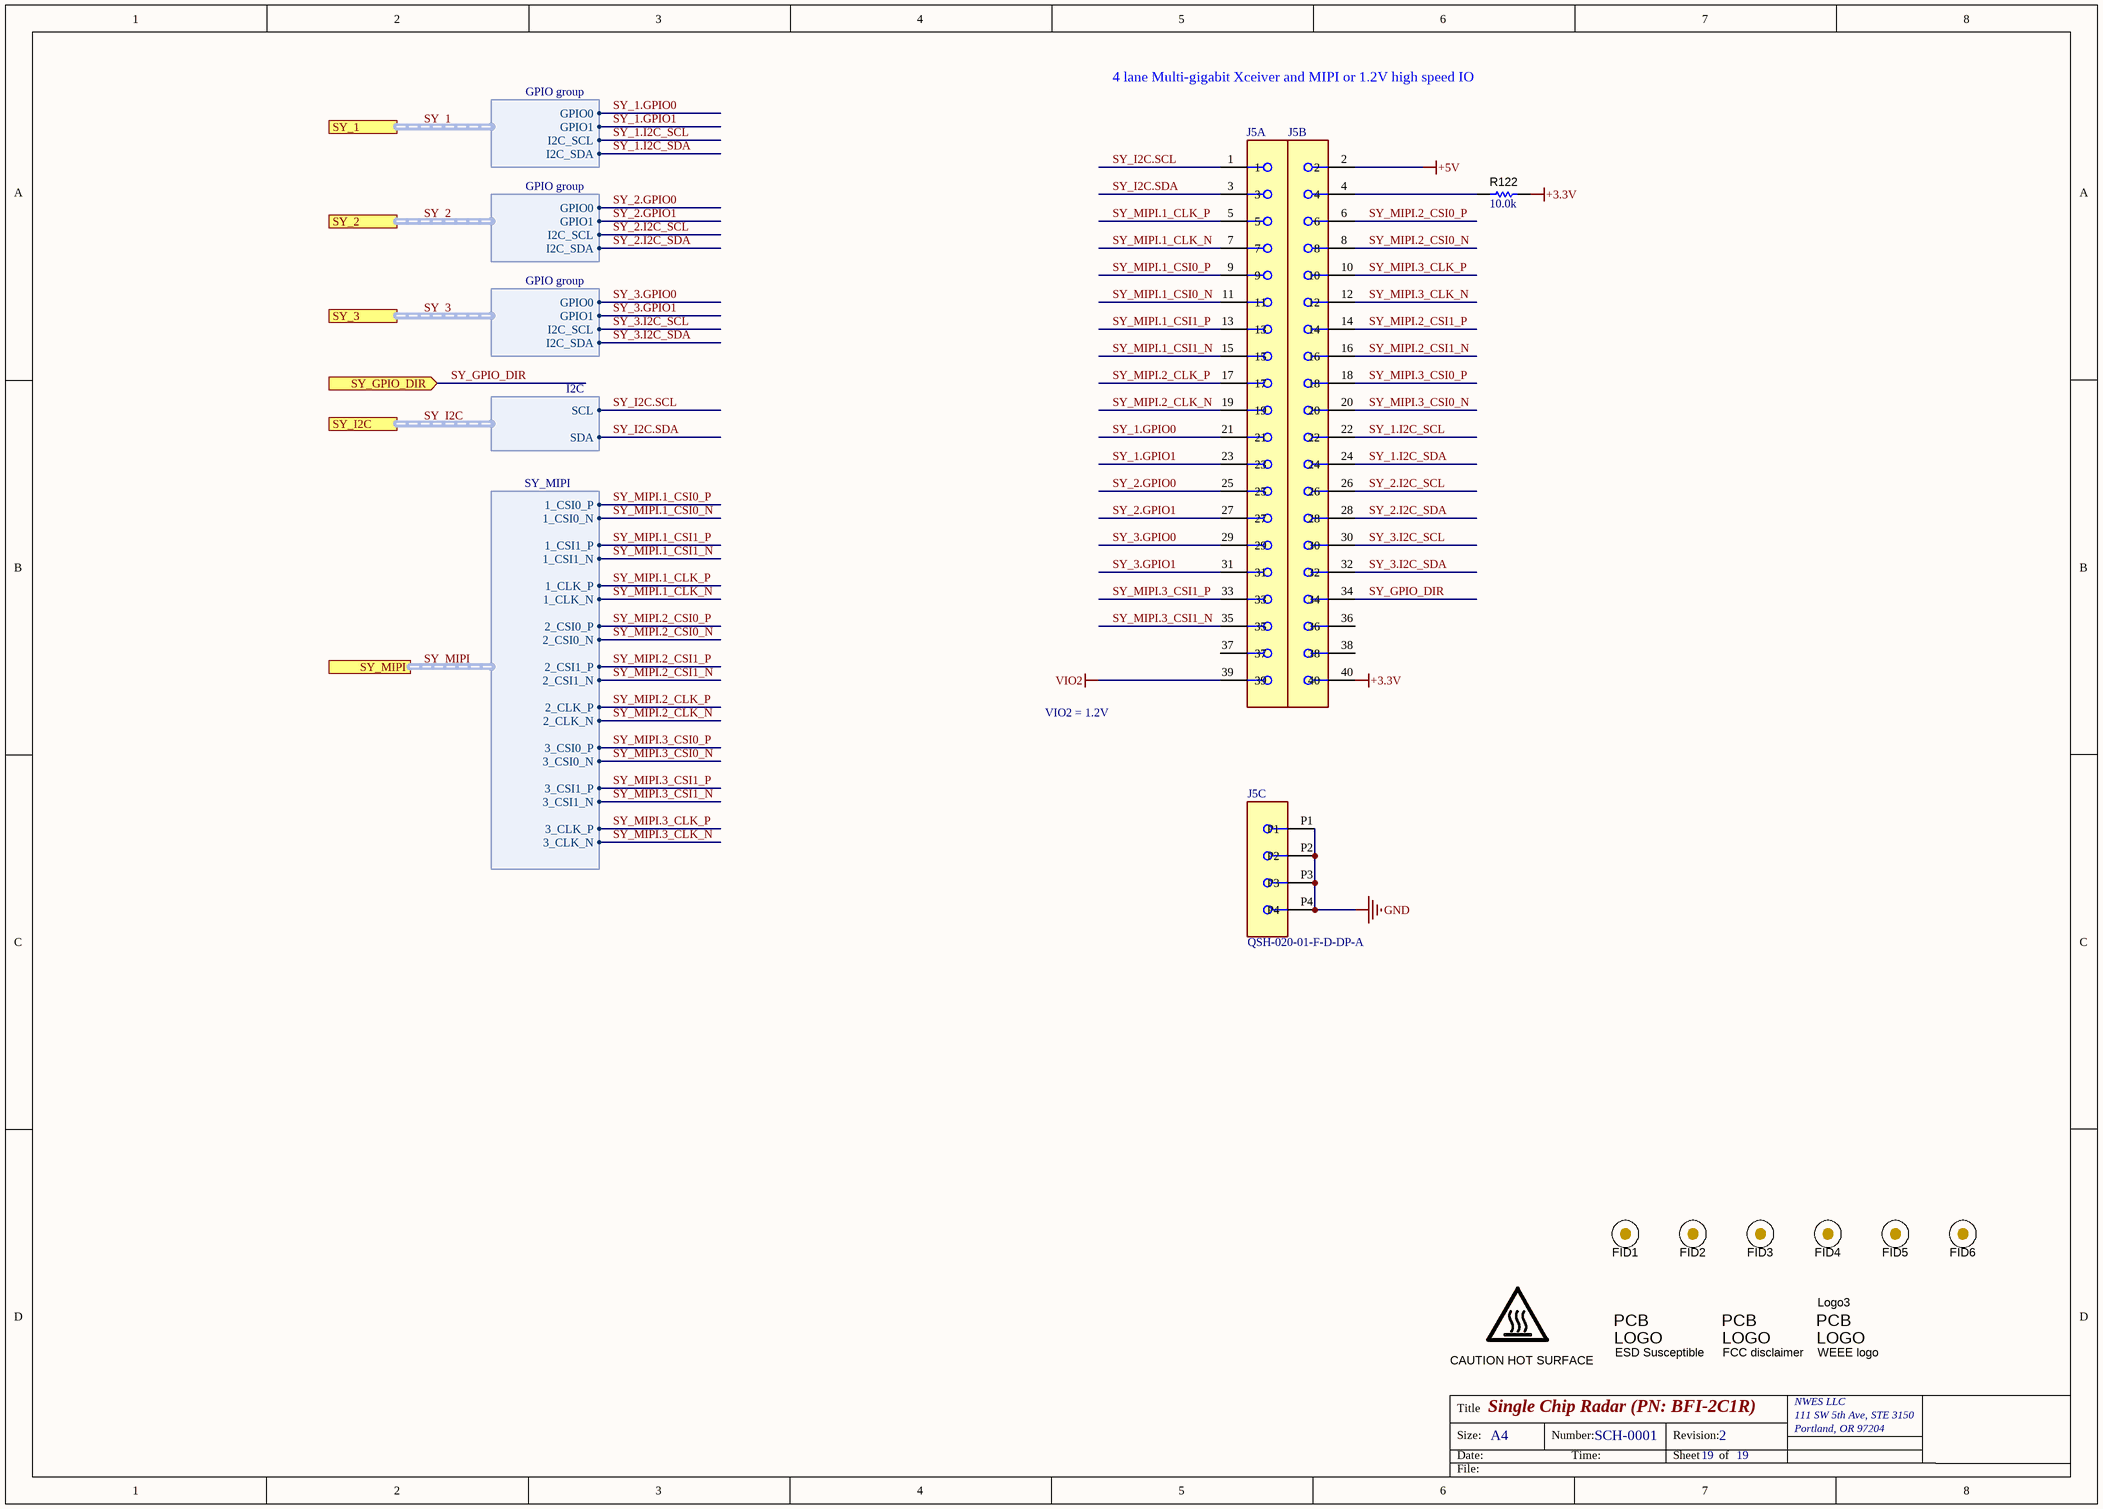
[diagram p18: EVK External Connector.SchDoc]

### Parts
ESD_Susceptible1  ESD Susceptible  [ESD_Overlay_Small]  (no BOM)
FID1  Fiducial  [Fiducial10-20]  (value not drawn)
FID2  Fiducial  [Fiducial10-20]  (value not drawn)
FID3  Fiducial  [Fiducial10-20]  (value not drawn)
FID4  Fiducial  [Fiducial10-20]  (value not drawn)
FID5  Fiducial  [Fiducial10-20]  (value not drawn)
FID6  Fiducial  [Fiducial10-20]  (value not drawn)
J5  QSH-020-01-F-D-DP-A  [FP-QSH-020-01-F-D-DP-A-MFG]  (value not drawn)  (parts A,B,C of 3)
Logo2  FCC disclaimer  [FCC_disclaimer]  (no BOM)
Logo3  WEEE logo  [WEEE_Minimum]  (no BOM)
LOGO4  CAUTION HOT SURFACE  [IEC_HotSurface_Small]  (no BOM)
R122  ValueDisplayed: 10.0k  [0402L]  (hidden comment: CRCW040210K0FKED)

### Ports
SY_1 (harness GPIO group), SY_2 (harness GPIO group), SY_3 (harness GPIO group), SY_GPIO_DIR (in), SY_I2C (harness I2C), SY_MIPI (harness SY_MIPI)

### Harnesses
I2C: SCL, SDA
GPIO group: GPIO0, GPIO1, I2C_SCL, I2C_SDA
SY_MIPI: 1_CSI0_P, 1_CSI0_N, 1_CSI1_P, 1_CSI1_N, 1_CLK_P, 1_CLK_N, 2_CSI0_P, 2_CSI0_N, 2_CSI1_P, 2_CSI1_N, 2_CLK_P, 2_CLK_N, 3_CSI0_P, 3_CSI0_N, 3_CSI1_P, 3_CSI1_N, 3_CLK_P, 3_CLK_N

### Nets
+3.3V: J5.40 R122.1
+5V: J5.2
GND: J5.P1 J5.P2 J5.P3 J5.P4
VIO2: J5.39
SY_1.GPIO0: J5.21 ; port SY_1.GPIO0
SY_1.GPIO1: J5.23 ; port SY_1.GPIO1
SY_1.I2C_SCL: J5.22 ; port SY_1.I2C_SCL
SY_1.I2C_SDA: J5.24 ; port SY_1.I2C_SDA
SY_2.GPIO0: J5.25 ; port SY_2.GPIO0
SY_2.GPIO1: J5.27 ; port SY_2.GPIO1
SY_2.I2C_SCL: J5.26 ; port SY_2.I2C_SCL
SY_2.I2C_SDA: J5.28 ; port SY_2.I2C_SDA
SY_3.GPIO0: J5.29 ; port SY_3.GPIO0
SY_3.GPIO1: J5.31 ; port SY_3.GPIO1
SY_3.I2C_SCL: J5.30 ; port SY_3.I2C_SCL
SY_3.I2C_SDA: J5.32 ; port SY_3.I2C_SDA
SY_GPIO_DIR: J5.34 ; port SY_GPIO_DIR
SY_I2C.SCL: J5.1 ; port SY_I2C.SCL
SY_I2C.SDA: J5.3 ; port SY_I2C.SDA
SY_MIPI.1_CLK_N: J5.7 ; port SY_MIPI.1_CLK_N
SY_MIPI.1_CLK_P: J5.5 ; port SY_MIPI.1_CLK_P
SY_MIPI.1_CSI0_N: J5.11 ; port SY_MIPI.1_CSI0_N
SY_MIPI.1_CSI0_P: J5.9 ; port SY_MIPI.1_CSI0_P
SY_MIPI.1_CSI1_N: J5.15 ; port SY_MIPI.1_CSI1_N
SY_MIPI.1_CSI1_P: J5.13 ; port SY_MIPI.1_CSI1_P
SY_MIPI.2_CLK_N: J5.19 ; port SY_MIPI.2_CLK_N
SY_MIPI.2_CLK_P: J5.17 ; port SY_MIPI.2_CLK_P
SY_MIPI.2_CSI0_N: J5.8 ; port SY_MIPI.2_CSI0_N
SY_MIPI.2_CSI0_P: J5.6 ; port SY_MIPI.2_CSI0_P
SY_MIPI.2_CSI1_N: J5.16 ; port SY_MIPI.2_CSI1_N
SY_MIPI.2_CSI1_P: J5.14 ; port SY_MIPI.2_CSI1_P
SY_MIPI.3_CLK_N: J5.12 ; port SY_MIPI.3_CLK_N
SY_MIPI.3_CLK_P: J5.10 ; port SY_MIPI.3_CLK_P
SY_MIPI.3_CSI0_N: J5.20 ; port SY_MIPI.3_CSI0_N
SY_MIPI.3_CSI0_P: J5.18 ; port SY_MIPI.3_CSI0_P
SY_MIPI.3_CSI1_N: J5.35 ; port SY_MIPI.3_CSI1_N
SY_MIPI.3_CSI1_P: J5.33 ; port SY_MIPI.3_CSI1_P
NetJ5_4: J5.4 R122.2

Not connected (* = marked no-connect by the designer): J5 36 37 38

### Buses and harness runs
harness SY_1 = port SY_1
harness SY_2 = port SY_2
harness SY_3 = port SY_3
harness SY_I2C = port SY_I2C
harness SY_MIPI = port SY_MIPI

### Notes on the sheet
- 4 lane Multi-gigabit Xceiver and MIPI or 1.2V high speed IO
- VIO2 = 1.2V
- Title
- Size:
- Date:
- A4
- Number:
- Time:
- Revision:
- Sheet
- of
- File:
- (in symbol CMP-0074769-1) PCB; LOGO
- (in symbol CMP-0074840-1) PCB; LOGO
- (in symbol CMP-0074847-1) PCB; LOGO

### Library data of the parts
ESD_Susceptible1 = CMP-0074840-1: ESD Susceptible Symbol; Library Reference: Logo; SymbolCreator: a0412235; Lib Reference: ESD_Susceptible; Publisher: Texas Instruments; SymbolVersion: 2011-08-22; Published: 2009-03-03; LatestRevisionDate: 2017-07-06; PartNumber: ESD Susceptible
FID1-FID6 = CMP-0077181-1: Fiducial mark.  There is nothing to buy or mount.; CompType: Fiducial; Manufacturer: N/A; MountType: N/A; PackageReference: N/A; PartNumber: N/A; ClassName: FiducialMark; Library Reference: Fiducial
J5 = CMP-02761-000036-3: CONN DIFF ARRAY RCP 40P SMD GOLD; NexarPartId: 12550277; Manufacturer Lifecycle Status: PRODUCTION; Manufacturer: Samtec; Voltage Rating: 175V; Pitch: 500µm; Voltage Rating (AC): 125V; Gender: Female; Number of Contacts: 40; Depth: 7.24mm; Contact Plating: Gold; Packaging: Bulk; Height: 3.327mm; Contact Material: Bronze, Gold, Nickel; Lifecycle Status: Production; Number of Rows: 2; Termination: Solder; RoHS: Compliant; Max Operating Temperature: 125°C; Lead Free: Lead Free; Orientation: Straight; Housing Color: Black; Housing Material: Polymer; Max Voltage Rating (AC): 125V; Length: 21.27mm; Min Operating Temperature: -55°C; Radiation Hardening: No; Manufacturer Part Number: QSH-020-01-F-D-DP-A
Logo2 = CMP-0074847-1: FCC_disclaimer; Library Reference: Logo; Published: 2009-03-03; Publisher: Texas Instruments; LatestRevisionDate: 2017-07-06; Lib Reference: FCC_disclaimer; PartNumber: FCC disclaimer
Logo3 = CMP-0074769-1: Library Reference: WEEE logo; Lib Reference: WEEE logo; PartNumber: WEEE logo
LOGO4 = CMP-0074837-1: IEC 61010-1 Hot Surface Warning; Library Reference: IEC_HotSurface; SymbolCreator: a0412235; Publisher: Texas Instruments; SymbolVersion: 2011-08-22; Published: 2009-03-03; Lib Reference: IEC_HotSurface; LatestRevisionDate: 2017-07-06; PartNumber: CAUTION HOT SURFACE
R122 = CMP-0025958-3: RES, 10.0 k, 1%, 0.063 W, AEC-Q200 Grade 0, 0402; Manufacturer: Vishay-Dale; Power_W: 63mW; TempCo: 100 ppm/C; Value_Code: 10k0; Value: 10.0k; EIA_Code: E96; Res_ohm: 10k; SizeX_mm: 1; SizeY_mm: 0.5; SizeZ_mm: 0.6; Value2: 0.063W; AEC Qualified: Y; VDC_V: 50V; AEC Category: Q200; AEC Grade: 0; Supplier Part Number 2: 52K6595; Supplier 2: Newark; Supplier Part Number 3: 71-CRCW0402-10K-E3; Supplier 3: Mouser; RoHS: E; Value1: 1%; MountType: SMT; Supplier 1: Digi-Key; PackageReference: 0402; Tolerance_%: 1%; SizeArea_mm2: 0.5; CompType: Resistor; PartNumber: CRCW040210K0FKED; ComponentLink1Description: Datasheet link; Supplier Part Number 1: 541-10.0KLCT-ND; Technology: Thick Film; ComponentLink1URL: http://www.vishay.com/docs/20035/dcrcwe3.pdf